# Altium project SOM Board with RK3399.PrjPcb (part 2 of 4)

## Sheet [8]-RK3399 SDRAM Page.SchDoc: RK3399 SOM Board Design V1.0
size A3; Author: ABC; Organization: Altium Limited; Address1: L3, 12a Rodborough Rd; Address2: Frenchs Forest; Address3: NSW; Address4: Australia 2086; DocumentNumber: 10; SheetNumber: 10; SheetTotal: 21; PROJECT CODE: A_V1.0
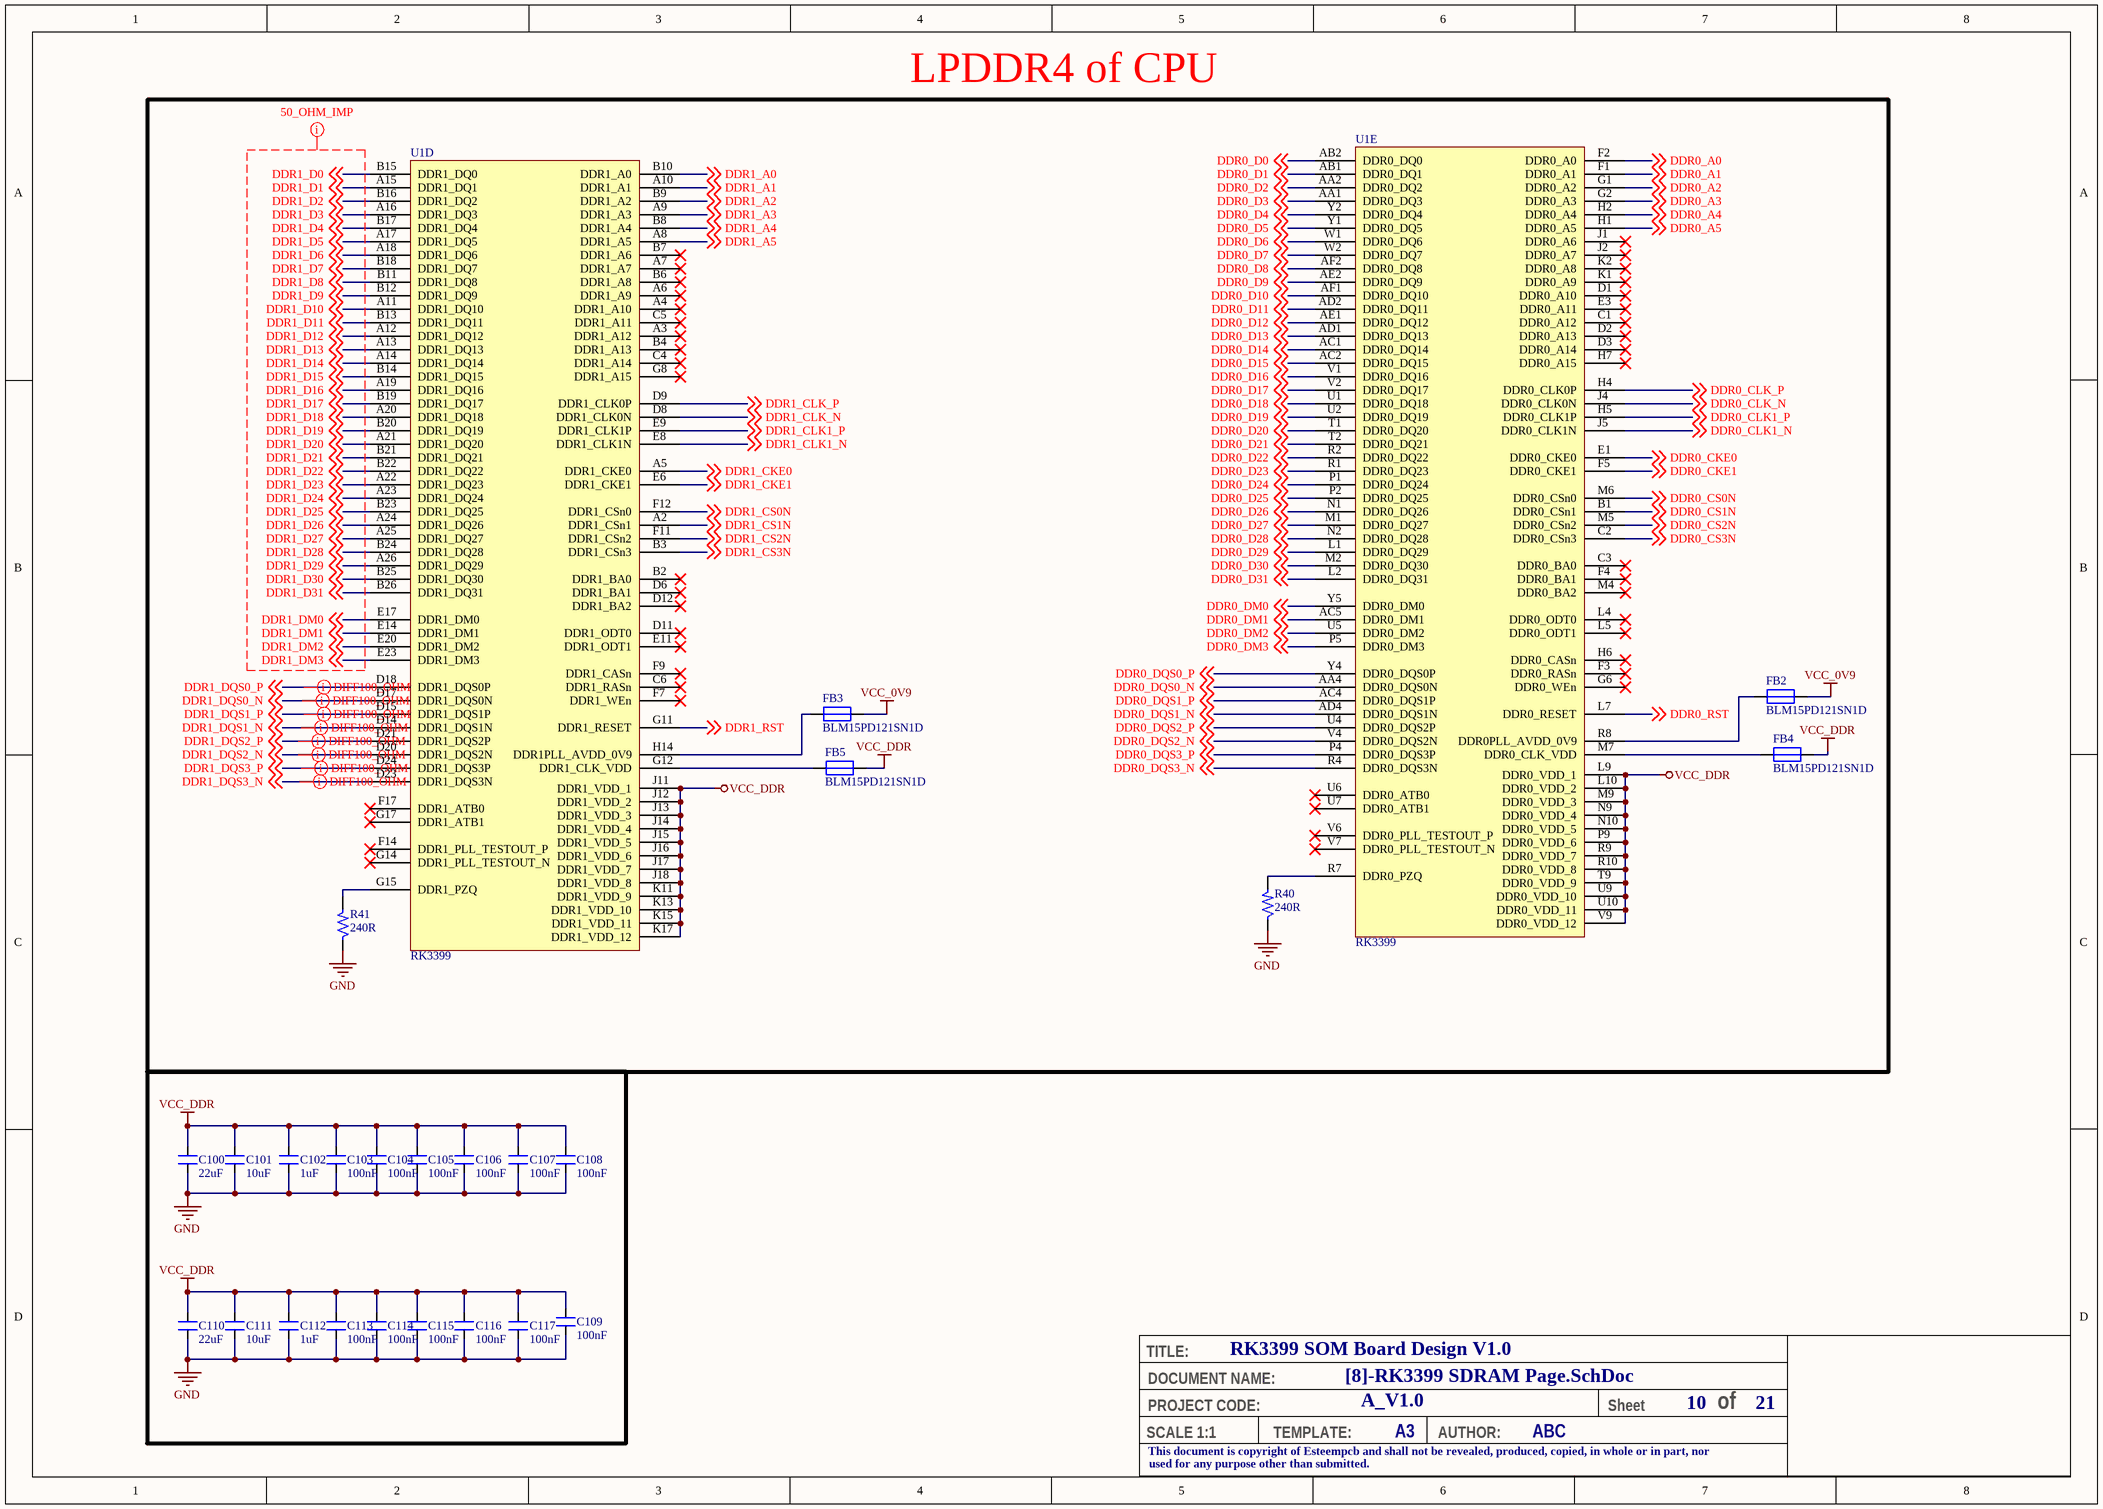
[diagram p9: [8]-RK3399 SDRAM Page.SchDoc]

### Parts
C100  22uF  [CAP_0402]
C101  10uF  [CAP_0402]
C102  1uF  [CAP_0201]
C103  100nF  [CAP_0201]
C104  100nF  [CAP_0201]
C105  100nF  [CAP_0201]
C106  100nF  [CAP_0201]
C107  100nF  [CAP_0201]
C108  100nF  [CAP_0201]
C109  100nF  [CAP_0201]
C110  22uF  [CAP_0402]
C111  10uF  [CAP_0402]
C112  1uF  [CAP_0201]
C113  100nF  [CAP_0201]
C114  100nF  [CAP_0201]
C115  100nF  [CAP_0201]
C116  100nF  [CAP_0201]
C117  100nF  [CAP_0201]
FB2  BLM15PD121SN1D  [RES_0402]
FB3  BLM15PD121SN1D  [RES_0402]
FB4  BLM15PD121SN1D  [RES_0402]
FB5  BLM15PD121SN1D  [RES_0402]
R40  240R  [RES_0201]
R41  240R  [RES_0201]
U1  RK3399  [FBGA828_23_826X826]  (parts D,E of 24)

### Blocks framed on the sheet
LPDDR4 of CPU: FB2-FB5 R40 R41 U1

### Nets
GND: C100.1 C101.1 C102.1 C103.1 C104.1 C105.1 C106.1 C107.1 C108.1 C109.1 C110.1 C111.1 C112.1 C113.1 C114.1 C115.1 C116.1 C117.1 R40.1 R41.1
VCC_0V9: FB2.2 FB3.2
VCC_DDR: C100.2 C101.2 C102.2 C103.2 C104.2 C105.2 C106.2 C107.2 C108.2 C109.2 C110.2 C111.2 C112.2 C113.2 C114.2 C115.2 C116.2 C117.2 FB4.2 FB5.2 U1.J11(DDR1_VDD_1) U1.J12(DDR1_VDD_2) U1.J13(DDR1_VDD_3) U1.J14(DDR1_VDD_4) U1.J15(DDR1_VDD_5) U1.J16(DDR1_VDD_6) U1.J17(DDR1_VDD_7) U1.J18(DDR1_VDD_8) U1.K11(DDR1_VDD_9) U1.K13(DDR1_VDD_10) U1.K15(DDR1_VDD_11) U1.K17(DDR1_VDD_12) U1.L9(DDR0_VDD_1) U1.L10(DDR0_VDD_2) U1.M9(DDR0_VDD_3) U1.N9(DDR0_VDD_4) U1.N10(DDR0_VDD_5) U1.P9(DDR0_VDD_6) U1.R9(DDR0_VDD_7) U1.R10(DDR0_VDD_8) U1.T9(DDR0_VDD_9) U1.U9(DDR0_VDD_10) U1.U10(DDR0_VDD_11) U1.V9(DDR0_VDD_12)
DDR0_A0: U1.F2(DDR0_A0) ; off-sheet DDR0_A0
DDR0_A1: U1.F1(DDR0_A1) ; off-sheet DDR0_A1
DDR0_A2: U1.G1(DDR0_A2) ; off-sheet DDR0_A2
DDR0_A3: U1.G2(DDR0_A3) ; off-sheet DDR0_A3
DDR0_A4: U1.H2(DDR0_A4) ; off-sheet DDR0_A4
DDR0_A5: U1.H1(DDR0_A5) ; off-sheet DDR0_A5
DDR0_CKE0: U1.E1(DDR0_CKE0) ; off-sheet DDR0_CKE0
DDR0_CKE1: U1.F5(DDR0_CKE1) ; off-sheet DDR0_CKE1
DDR0_CLK1_N: U1.J5(DDR0_CLK1N) ; off-sheet DDR0_CLK1_N
DDR0_CLK1_P: U1.H5(DDR0_CLK1P) ; off-sheet DDR0_CLK1_P
DDR0_CLK_N: U1.J4(DDR0_CLK0N) ; off-sheet DDR0_CLK_N
DDR0_CLK_P: U1.H4(DDR0_CLK0P) ; off-sheet DDR0_CLK_P
DDR0_CS0N: U1.M6(DDR0_CSn0) ; off-sheet DDR0_CS0N
DDR0_CS1N: U1.B1(DDR0_CSn1) ; off-sheet DDR0_CS1N
DDR0_CS2N: U1.M5(DDR0_CSn2) ; off-sheet DDR0_CS2N
DDR0_CS3N: U1.C2(DDR0_CSn3) ; off-sheet DDR0_CS3N
DDR0_D0: U1.AB2(DDR0_DQ0) ; off-sheet DDR0_D0
DDR0_D1: U1.AB1(DDR0_DQ1) ; off-sheet DDR0_D1
DDR0_D2: U1.AA2(DDR0_DQ2) ; off-sheet DDR0_D2
DDR0_D3: U1.AA1(DDR0_DQ3) ; off-sheet DDR0_D3
DDR0_D4: U1.Y2(DDR0_DQ4) ; off-sheet DDR0_D4
DDR0_D5: U1.Y1(DDR0_DQ5) ; off-sheet DDR0_D5
DDR0_D6: U1.W1(DDR0_DQ6) ; off-sheet DDR0_D6
DDR0_D7: U1.W2(DDR0_DQ7) ; off-sheet DDR0_D7
DDR0_D8: U1.AF2(DDR0_DQ8) ; off-sheet DDR0_D8
DDR0_D9: U1.AE2(DDR0_DQ9) ; off-sheet DDR0_D9
DDR0_D10: U1.AF1(DDR0_DQ10) ; off-sheet DDR0_D10
DDR0_D11: U1.AD2(DDR0_DQ11) ; off-sheet DDR0_D11
DDR0_D12: U1.AE1(DDR0_DQ12) ; off-sheet DDR0_D12
DDR0_D13: U1.AD1(DDR0_DQ13) ; off-sheet DDR0_D13
DDR0_D14: U1.AC1(DDR0_DQ14) ; off-sheet DDR0_D14
DDR0_D15: U1.AC2(DDR0_DQ15) ; off-sheet DDR0_D15
DDR0_D16: U1.V1(DDR0_DQ16) ; off-sheet DDR0_D16
DDR0_D17: U1.V2(DDR0_DQ17) ; off-sheet DDR0_D17
DDR0_D18: U1.U1(DDR0_DQ18) ; off-sheet DDR0_D18
DDR0_D19: U1.U2(DDR0_DQ19) ; off-sheet DDR0_D19
DDR0_D20: U1.T1(DDR0_DQ20) ; off-sheet DDR0_D20
DDR0_D21: U1.T2(DDR0_DQ21) ; off-sheet DDR0_D21
DDR0_D22: U1.R2(DDR0_DQ22) ; off-sheet DDR0_D22
DDR0_D23: U1.R1(DDR0_DQ23) ; off-sheet DDR0_D23
DDR0_D24: U1.P1(DDR0_DQ24) ; off-sheet DDR0_D24
DDR0_D25: U1.P2(DDR0_DQ25) ; off-sheet DDR0_D25
DDR0_D26: U1.N1(DDR0_DQ26) ; off-sheet DDR0_D26
DDR0_D27: U1.M1(DDR0_DQ27) ; off-sheet DDR0_D27
DDR0_D28: U1.N2(DDR0_DQ28) ; off-sheet DDR0_D28
DDR0_D29: U1.L1(DDR0_DQ29) ; off-sheet DDR0_D29
DDR0_D30: U1.M2(DDR0_DQ30) ; off-sheet DDR0_D30
DDR0_D31: U1.L2(DDR0_DQ31) ; off-sheet DDR0_D31
DDR0_DM0: U1.Y5(DDR0_DM0) ; off-sheet DDR0_DM0
DDR0_DM1: U1.AC5(DDR0_DM1) ; off-sheet DDR0_DM1
DDR0_DM2: U1.U5(DDR0_DM2) ; off-sheet DDR0_DM2
DDR0_DM3: U1.P5(DDR0_DM3) ; off-sheet DDR0_DM3
DDR0_DQS0_N: U1.AA4(DDR0_DQS0N) ; off-sheet DDR0_DQS0_N
DDR0_DQS0_P: U1.Y4(DDR0_DQS0P) ; off-sheet DDR0_DQS0_P
DDR0_DQS1_N: U1.AD4(DDR0_DQS1N) ; off-sheet DDR0_DQS1_N
DDR0_DQS1_P: U1.AC4(DDR0_DQS1P) ; off-sheet DDR0_DQS1_P
DDR0_DQS2_N: U1.V4(DDR0_DQS2N) ; off-sheet DDR0_DQS2_N
DDR0_DQS2_P: U1.U4(DDR0_DQS2P) ; off-sheet DDR0_DQS2_P
DDR0_DQS3_N: U1.R4(DDR0_DQS3N) ; off-sheet DDR0_DQS3_N
DDR0_DQS3_P: U1.P4(DDR0_DQS3P) ; off-sheet DDR0_DQS3_P
DDR0_RST: U1.L7(DDR0_RESET) ; off-sheet DDR0_RST
DDR1_A0: U1.B10(DDR1_A0) ; off-sheet DDR1_A0
DDR1_A1: U1.A10(DDR1_A1) ; off-sheet DDR1_A1
DDR1_A2: U1.B9(DDR1_A2) ; off-sheet DDR1_A2
DDR1_A3: U1.A9(DDR1_A3) ; off-sheet DDR1_A3
DDR1_A4: U1.B8(DDR1_A4) ; off-sheet DDR1_A4
DDR1_A5: U1.A8(DDR1_A5) ; off-sheet DDR1_A5
DDR1_CKE0: U1.A5(DDR1_CKE0) ; off-sheet DDR1_CKE0
DDR1_CKE1: U1.E6(DDR1_CKE1) ; off-sheet DDR1_CKE1
DDR1_CLK1_N: U1.E8(DDR1_CLK1N) ; off-sheet DDR1_CLK1_N
DDR1_CLK1_P: U1.E9(DDR1_CLK1P) ; off-sheet DDR1_CLK1_P
DDR1_CLK_N: U1.D8(DDR1_CLK0N) ; off-sheet DDR1_CLK_N
DDR1_CLK_P: U1.D9(DDR1_CLK0P) ; off-sheet DDR1_CLK_P
DDR1_CS0N: U1.F12(DDR1_CSn0) ; off-sheet DDR1_CS0N
DDR1_CS1N: U1.A2(DDR1_CSn1) ; off-sheet DDR1_CS1N
DDR1_CS2N: U1.F11(DDR1_CSn2) ; off-sheet DDR1_CS2N
DDR1_CS3N: U1.B3(DDR1_CSn3) ; off-sheet DDR1_CS3N
DDR1_D0: U1.B15(DDR1_DQ0) ; off-sheet DDR1_D0
DDR1_D1: U1.A15(DDR1_DQ1) ; off-sheet DDR1_D1
DDR1_D2: U1.B16(DDR1_DQ2) ; off-sheet DDR1_D2
DDR1_D3: U1.A16(DDR1_DQ3) ; off-sheet DDR1_D3
DDR1_D4: U1.B17(DDR1_DQ4) ; off-sheet DDR1_D4
DDR1_D5: U1.A17(DDR1_DQ5) ; off-sheet DDR1_D5
DDR1_D6: U1.A18(DDR1_DQ6) ; off-sheet DDR1_D6
DDR1_D7: U1.B18(DDR1_DQ7) ; off-sheet DDR1_D7
DDR1_D8: U1.B11(DDR1_DQ8) ; off-sheet DDR1_D8
DDR1_D9: U1.B12(DDR1_DQ9) ; off-sheet DDR1_D9
DDR1_D10: U1.A11(DDR1_DQ10) ; off-sheet DDR1_D10
DDR1_D11: U1.B13(DDR1_DQ11) ; off-sheet DDR1_D11
DDR1_D12: U1.A12(DDR1_DQ12) ; off-sheet DDR1_D12
DDR1_D13: U1.A13(DDR1_DQ13) ; off-sheet DDR1_D13
DDR1_D14: U1.A14(DDR1_DQ14) ; off-sheet DDR1_D14
DDR1_D15: U1.B14(DDR1_DQ15) ; off-sheet DDR1_D15
DDR1_D16: U1.A19(DDR1_DQ16) ; off-sheet DDR1_D16
DDR1_D17: U1.B19(DDR1_DQ17) ; off-sheet DDR1_D17
DDR1_D18: U1.A20(DDR1_DQ18) ; off-sheet DDR1_D18
DDR1_D19: U1.B20(DDR1_DQ19) ; off-sheet DDR1_D19
DDR1_D20: U1.A21(DDR1_DQ20) ; off-sheet DDR1_D20
DDR1_D21: U1.B21(DDR1_DQ21) ; off-sheet DDR1_D21
DDR1_D22: U1.B22(DDR1_DQ22) ; off-sheet DDR1_D22
DDR1_D23: U1.A22(DDR1_DQ23) ; off-sheet DDR1_D23
DDR1_D24: U1.A23(DDR1_DQ24) ; off-sheet DDR1_D24
DDR1_D25: U1.B23(DDR1_DQ25) ; off-sheet DDR1_D25
DDR1_D26: U1.A24(DDR1_DQ26) ; off-sheet DDR1_D26
DDR1_D27: U1.A25(DDR1_DQ27) ; off-sheet DDR1_D27
DDR1_D28: U1.B24(DDR1_DQ28) ; off-sheet DDR1_D28
DDR1_D29: U1.A26(DDR1_DQ29) ; off-sheet DDR1_D29
DDR1_D30: U1.B25(DDR1_DQ30) ; off-sheet DDR1_D30
DDR1_D31: U1.B26(DDR1_DQ31) ; off-sheet DDR1_D31
DDR1_DM0: U1.E17(DDR1_DM0) ; off-sheet DDR1_DM0
DDR1_DM1: U1.E14(DDR1_DM1) ; off-sheet DDR1_DM1
DDR1_DM2: U1.E20(DDR1_DM2) ; off-sheet DDR1_DM2
DDR1_DM3: U1.E23(DDR1_DM3) ; off-sheet DDR1_DM3
DDR1_DQS0_N: U1.D17(DDR1_DQS0N) ; off-sheet DDR1_DQS0_N
DDR1_DQS0_P: U1.D18(DDR1_DQS0P) ; off-sheet DDR1_DQS0_P
DDR1_DQS1_N: U1.D14(DDR1_DQS1N) ; off-sheet DDR1_DQS1_N
DDR1_DQS1_P: U1.D15(DDR1_DQS1P) ; off-sheet DDR1_DQS1_P
DDR1_DQS2_N: U1.D20(DDR1_DQS2N) ; off-sheet DDR1_DQS2_N
DDR1_DQS2_P: U1.D21(DDR1_DQS2P) ; off-sheet DDR1_DQS2_P
DDR1_DQS3_N: U1.D23(DDR1_DQS3N) ; off-sheet DDR1_DQS3_N
DDR1_DQS3_P: U1.D24(DDR1_DQS3P) ; off-sheet DDR1_DQS3_P
DDR1_RST: U1.G11(DDR1_RESET) ; off-sheet DDR1_RST
NetFB2_1: FB2.1 U1.R8(DDR0PLL_AVDD_0V9)
NetFB3_1: FB3.1 U1.H14(DDR1PLL_AVDD_0V9)
NetFB4_1: FB4.1 U1.M7(DDR0_CLK_VDD)
NetFB5_1: FB5.1 U1.G12(DDR1_CLK_VDD)
NetR40_2: R40.2 U1.R7(DDR0_PZQ)
NetR41_2: R41.2 U1.G15(DDR1_PZQ)

Not connected (* = marked no-connect by the designer): U1 A3(DDR1_A12)* A4(DDR1_A10)* A6(DDR1_A9)* A7(DDR1_A7)* B2(DDR1_BA0)* B4(DDR1_A13)* B6(DDR1_A8)* B7(DDR1_A6)* C1(DDR0_A12)* C3(DDR0_BA0)* C4(DDR1_A14)* C5(DDR1_A11)* C6(DDR1_RASn)* D1(DDR0_A10)* D2(DDR0_A13)* D3(DDR0_A14)* D6(DDR1_BA1)* D11(DDR1_ODT0)* D12(DDR1_BA2)* E3(DDR0_A11)* E11(DDR1_ODT1)* F3(DDR0_RASn)* F4(DDR0_BA1)* F7(DDR1_WEn)* F9(DDR1_CASn)* F14(DDR1_PLL_TESTOUT_P)* F17(DDR1_ATB0)* G6(DDR0_WEn)* G8(DDR1_A15)* G14(DDR1_PLL_TESTOUT_N)* G17(DDR1_ATB1)* H6(DDR0_CASn)* H7(DDR0_A15)* J1(DDR0_A6)* J2(DDR0_A7)* K1(DDR0_A9)* K2(DDR0_A8)* L4(DDR0_ODT0)* L5(DDR0_ODT1)* M4(DDR0_BA2)* U6(DDR0_ATB0)* U7(DDR0_ATB1)* V6(DDR0_PLL_TESTOUT_P)* V7(DDR0_PLL_TESTOUT_N)*

### Layout directives
net class 50_OHM_IMP: DDR1_D0, DDR1_D1, DDR1_D2, DDR1_D3, DDR1_D4, DDR1_D5, DDR1_D6, DDR1_D7, DDR1_D8, DDR1_D9, DDR1_D10, DDR1_D11, DDR1_D12, DDR1_D13, DDR1_D14, DDR1_D15, DDR1_D16, DDR1_D17, DDR1_D18, DDR1_D19, DDR1_D20, DDR1_D21, DDR1_D22, DDR1_D23, DDR1_D24, DDR1_D25, DDR1_D26, DDR1_D27, DDR1_D28, DDR1_D29, DDR1_D30, DDR1_D31, DDR1_DM0, DDR1_DM1, DDR1_DM2, DDR1_DM3
differential pair; differential pair class DIIF_100_OHM: DDR1_DQS0_N, DDR1_DQS0_P, DDR1_DQS1_N, DDR1_DQS1_P, DDR1_DQS2_N, DDR1_DQS2_P, DDR1_DQS3_N, DDR1_DQS3_P

### Notes on the sheet
- TITLE:
- DOCUMENT NAME:
- SCALE 1:1
- This document is copyright of Esteempcb and shall not be revealed, produced, copied, in whole or in part, nor
- PROJECT CODE:
- TEMPLATE:
- A3
- AUTHOR:
- Sheet
- of
- used for any purpose other than submitted.

### Library data of the parts
C100 C110 = CAP_22uF-6.3V-20%-0402: 22µF ±20% 6.3V Ceramic Capacitor X5R 0402 (1005 Metric) /; Manufacturer: Murata Electronics; Manufacturer Part Number: CL05A226MQ5N6J8; Case/Package: 0402; Supplier-1: Digikey
C101 C111 = CAP_10uF-10V-20%-0402: 10µF ±20% 10V Ceramic Capacitor X5R 0402 (1005 Metric) /; Manufacturer Part Number: CL05A106MP5NUNC; Manufacturer: Samsung Electro-Mechanics; Case/Package: 0402; Supplier-1: Digikey
C102 C112 = CAP_1uF-16V-10%-0201: 1µF ±20% 16V Ceramic Capacitor X5R 0201 (0603 Metric) /; Manufacturer: Samsung Electro-Mechanics; Manufacturer Part Number: CL03A105MO3NRNH; Case/Package: 0201; Supplier-1: Digikey
C103-C109 C113-C117 = CAP_100nF-25V-10%-0201: 0.1µF ±10% 25V Ceramic Capacitor X5R 0201 (0603 Metric) /; Manufacturer: TDK Corporation; Manufacturer Part Number: C0603X5R1E104K030BB; Case/Package: 0201; Supplier-1: Digikey
FB2-FB5 = FB_120R-1.3A-100Mhz-0402: 120 Ohms @ 100MHz 1 Power Line Ferrite Bead 0402 (1005 Metric) 1.3A 90mOhm; Manufacturer: Murata Electronics; Mnaufacturer Part Number: BLM15PD121SN1D; Case/Package: 0402; Supplier-1: Digikey
R40 R41 = RES_240R-0.05W-1%-0201: 240 Ohms ±1% 0.05W, 1/20W Chip Resistor 0201 (0603 Metric) Thick Film /; Manufacturer: Yageo; Manufacturer Part Number: RC0201FR-07240RL; Case/Package: 0201; Supplier-1: Digikey
U1 = IC_RK3399-FCBGA828: RK3399 is a low power, high performance processor for computing, personal mobile.; Manufacturer: Rockchip; Manufacturer Part Number: RK3399; Case/Package: FCBGA828; Supplier-1: Rockchip

## Sheet [9]-LPDDR4 SDRAM-1.SchDoc: RK3399 SOM Board Design V1.0
size A3; Author: ABC; Organization: Altium Limited; Address1: L3, 12a Rodborough Rd; Address2: Frenchs Forest; Address3: NSW; Address4: Australia 2086; DocumentNumber: 11; SheetNumber: 11; SheetTotal: 21; PROJECT CODE: A_V1.0
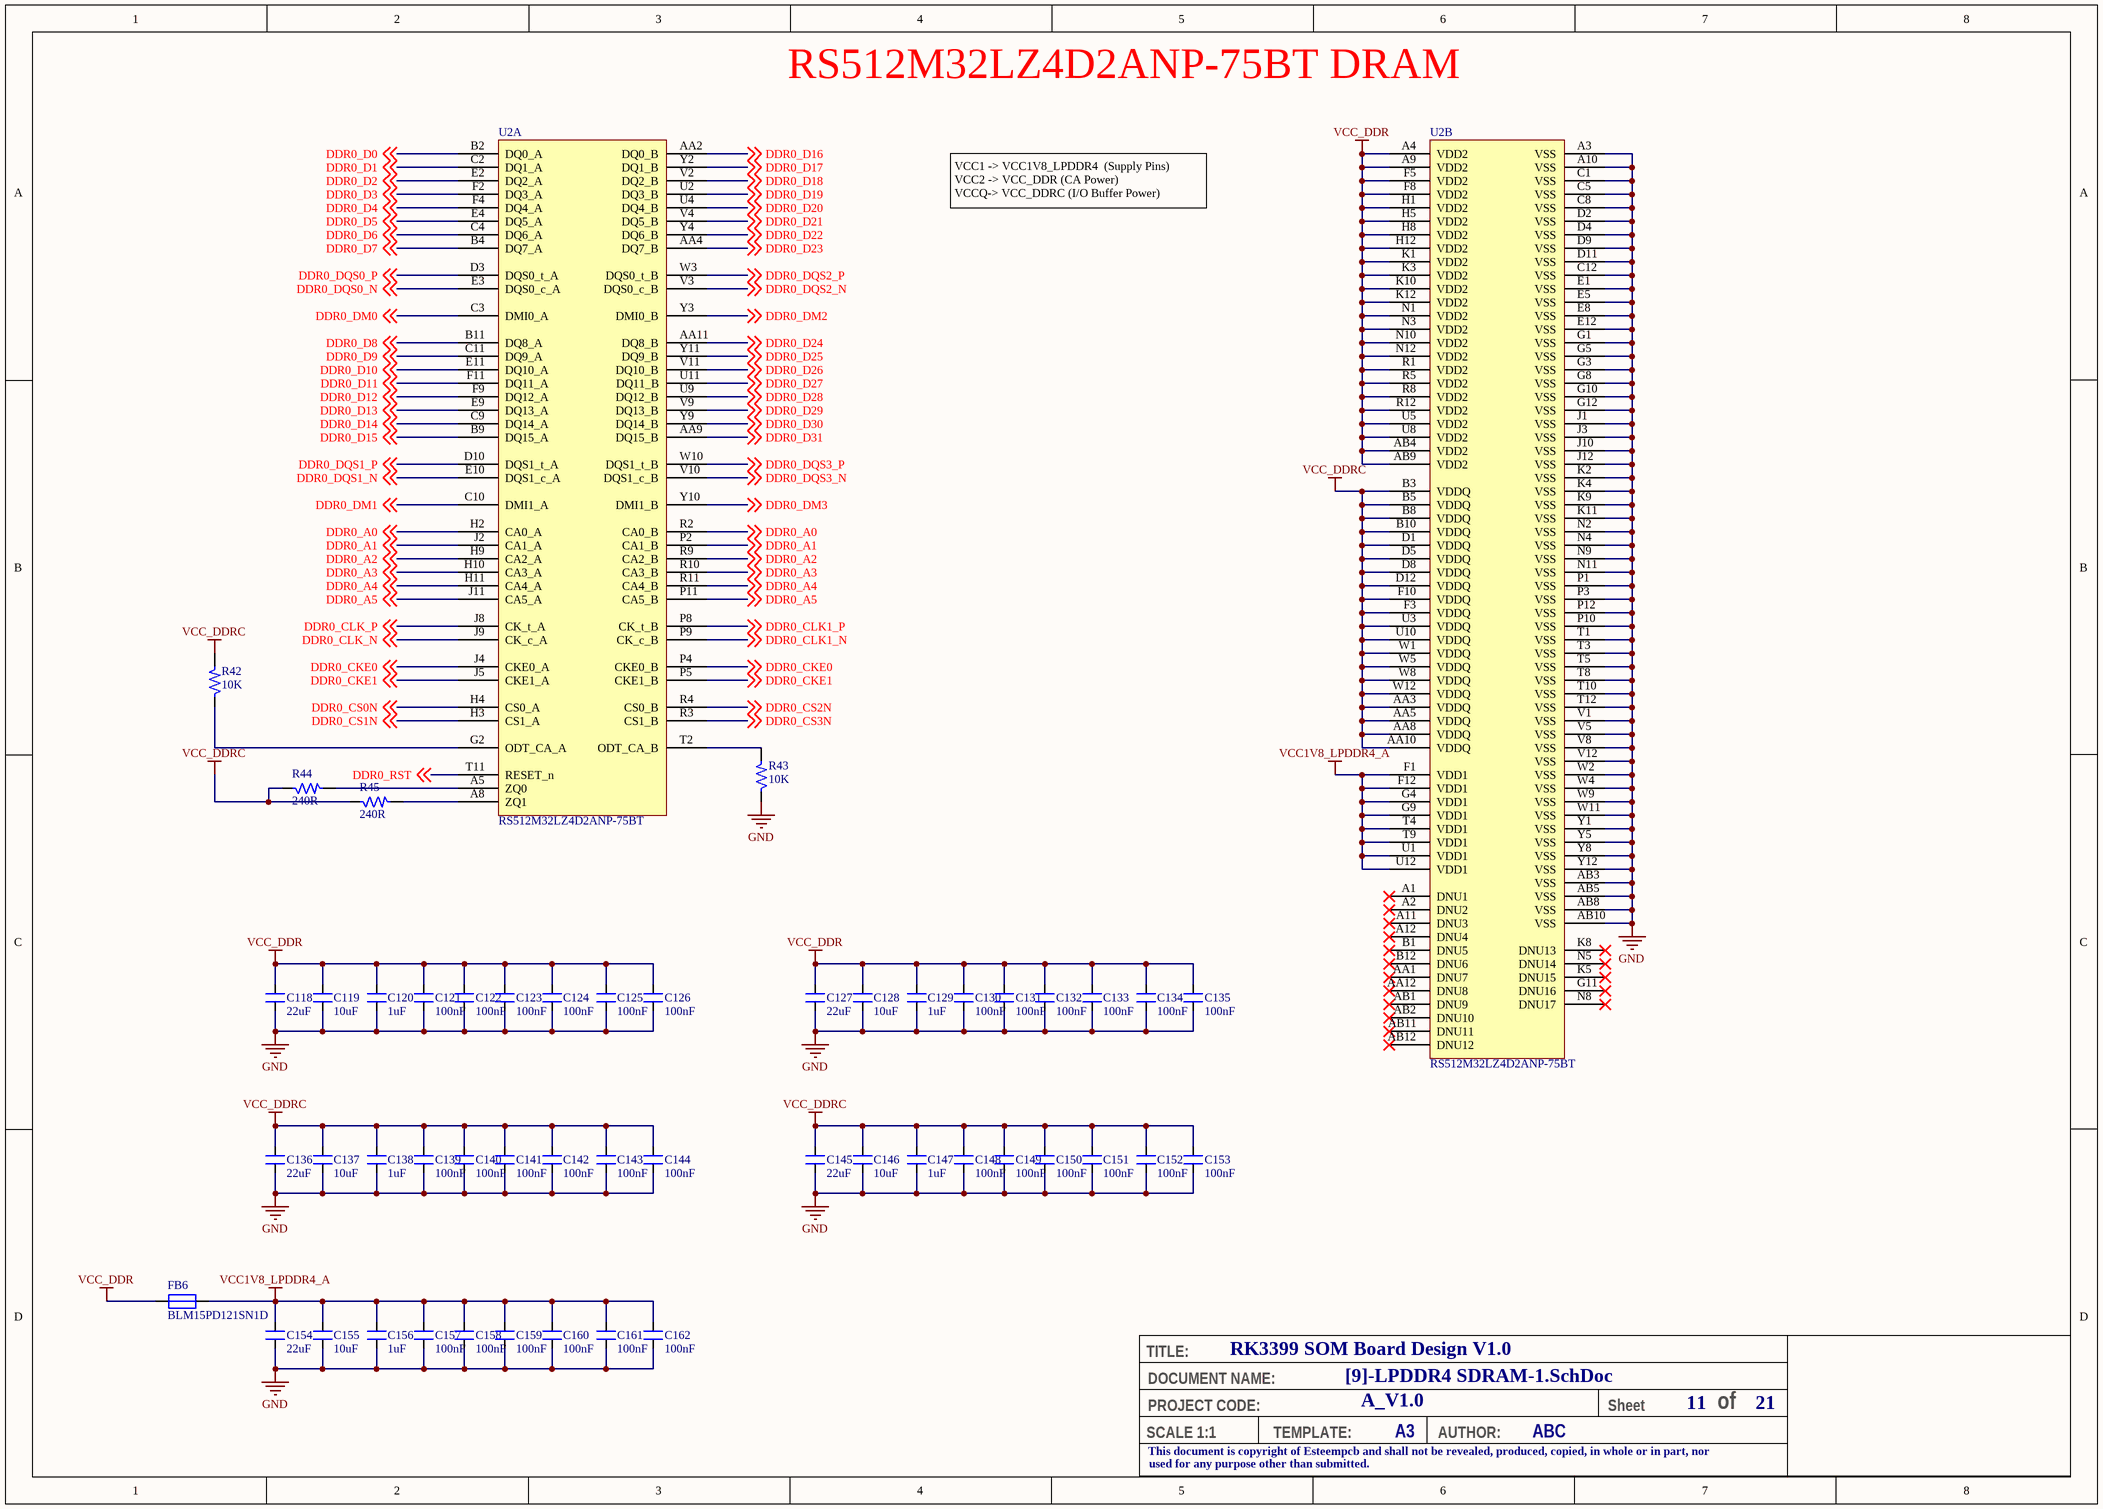
[diagram p10: [9]-LPDDR4 SDRAM-1.SchDoc]

### Parts
C118  22uF  [CAP_0402]
C119  10uF  [CAP_0402]
C120  1uF  [CAP_0201]
C121  100nF  [CAP_0201]
C122  100nF  [CAP_0201]
C123  100nF  [CAP_0201]
C124  100nF  [CAP_0201]
C125  100nF  [CAP_0201]
C126  100nF  [CAP_0201]
C127  22uF  [CAP_0402]
C128  10uF  [CAP_0402]
C129  1uF  [CAP_0201]
C130  100nF  [CAP_0201]
C131  100nF  [CAP_0201]
C132  100nF  [CAP_0201]
C133  100nF  [CAP_0201]
C134  100nF  [CAP_0201]
C135  100nF  [CAP_0201]
C136  22uF  [CAP_0402]
C137  10uF  [CAP_0402]
C138  1uF  [CAP_0201]
C139  100nF  [CAP_0201]
C140  100nF  [CAP_0201]
C141  100nF  [CAP_0201]
C142  100nF  [CAP_0201]
C143  100nF  [CAP_0201]
C144  100nF  [CAP_0201]
C145  22uF  [CAP_0402]
C146  10uF  [CAP_0402]
C147  1uF  [CAP_0201]
C148  100nF  [CAP_0201]
C149  100nF  [CAP_0201]
C150  100nF  [CAP_0201]
C151  100nF  [CAP_0201]
C152  100nF  [CAP_0201]
C153  100nF  [CAP_0201]
C154  22uF  [CAP_0402]
C155  10uF  [CAP_0402]
C156  1uF  [CAP_0201]
C157  100nF  [CAP_0201]
C158  100nF  [CAP_0201]
C159  100nF  [CAP_0201]
C160  100nF  [CAP_0201]
C161  100nF  [CAP_0201]
C162  100nF  [CAP_0201]
FB6  BLM15PD121SN1D  [RES_0402]
R42  10K  [RES_0201]
R43  10K  [RES_0201]
R44  240R  [RES_0201]
R45  240R  [RES_0201]
U2  RS512M32LZ4D2ANP-75BT  [FBGA200_SMD]  (parts A,B of 2)

### Nets
GND: C118.1 C119.1 C120.1 C121.1 C122.1 C123.1 C124.1 C125.1 C126.1 C127.1 C128.1 C129.1 C130.1 C131.1 C132.1 C133.1 C134.1 C135.1 C136.1 C137.1 C138.1 C139.1 C140.1 C141.1 C142.1 C143.1 C144.1 C145.1 C146.1 C147.1 C148.1 C149.1 C150.1 C151.1 C152.1 C153.1 C154.1 C155.1 C156.1 C157.1 C158.1 C159.1 C160.1 C161.1 C162.1 R43.1 U2.A3(VSS) U2.A10(VSS) U2.AB3(VSS) U2.AB5(VSS) U2.AB8(VSS) U2.AB10(VSS) U2.C1(VSS) U2.C5(VSS) U2.C8(VSS) U2.C12(VSS) U2.D2(VSS) U2.D4(VSS) U2.D9(VSS) U2.D11(VSS) U2.E1(VSS) U2.E5(VSS) U2.E8(VSS) U2.E12(VSS) U2.G1(VSS) U2.G3(VSS) U2.G5(VSS) U2.G8(VSS) U2.G10(VSS) U2.G12(VSS) U2.J1(VSS) U2.J3(VSS) U2.J10(VSS) U2.J12(VSS) U2.K2(VSS) U2.K4(VSS) U2.K9(VSS) U2.K11(VSS) U2.N2(VSS) U2.N4(VSS) U2.N9(VSS) U2.N11(VSS) U2.P1(VSS) U2.P3(VSS) U2.P10(VSS) U2.P12(VSS) U2.T1(VSS) U2.T3(VSS) U2.T5(VSS) U2.T8(VSS) U2.T10(VSS) U2.T12(VSS) U2.V1(VSS) U2.V5(VSS) U2.V8(VSS) U2.V12(VSS) U2.W2(VSS) U2.W4(VSS) U2.W9(VSS) U2.W11(VSS) U2.Y1(VSS) U2.Y5(VSS) U2.Y8(VSS) U2.Y12(VSS)
VCC1V8_LPDDR4_A: C154.2 C155.2 C156.2 C157.2 C158.2 C159.2 C160.2 C161.2 C162.2 FB6.2 U2.F1(VDD1) U2.F12(VDD1) U2.G4(VDD1) U2.G9(VDD1) U2.T4(VDD1) U2.T9(VDD1) U2.U1(VDD1) U2.U12(VDD1)
VCC_DDR: C118.2 C119.2 C120.2 C121.2 C122.2 C123.2 C124.2 C125.2 C126.2 C127.2 C128.2 C129.2 C130.2 C131.2 C132.2 C133.2 C134.2 C135.2 FB6.1 U2.A4(VDD2) U2.A9(VDD2) U2.AB4(VDD2) U2.AB9(VDD2) U2.F5(VDD2) U2.F8(VDD2) U2.H1(VDD2) U2.H5(VDD2) U2.H8(VDD2) U2.H12(VDD2) U2.K1(VDD2) U2.K3(VDD2) U2.K10(VDD2) U2.K12(VDD2) U2.N1(VDD2) U2.N3(VDD2) U2.N10(VDD2) U2.N12(VDD2) U2.R1(VDD2) U2.R5(VDD2) U2.R8(VDD2) U2.R12(VDD2) U2.U5(VDD2) U2.U8(VDD2)
VCC_DDRC: C136.2 C137.2 C138.2 C139.2 C140.2 C141.2 C142.2 C143.2 C144.2 C145.2 C146.2 C147.2 C148.2 C149.2 C150.2 C151.2 C152.2 C153.2 R42.2 R44.1 R45.1 U2.AA3(VDDQ) U2.AA5(VDDQ) U2.AA8(VDDQ) U2.AA10(VDDQ) U2.B3(VDDQ) U2.B5(VDDQ) U2.B8(VDDQ) U2.B10(VDDQ) U2.D1(VDDQ) U2.D5(VDDQ) U2.D8(VDDQ) U2.D12(VDDQ) U2.F3(VDDQ) U2.F10(VDDQ) U2.U3(VDDQ) U2.U10(VDDQ) U2.W1(VDDQ) U2.W5(VDDQ) U2.W8(VDDQ) U2.W12(VDDQ)
DDR0_A0: U2.H2(CA0_A) U2.R2(CA0_B) ; off-sheet DDR0_A0
DDR0_A1: U2.J2(CA1_A) U2.P2(CA1_B) ; off-sheet DDR0_A1
DDR0_A2: U2.H9(CA2_A) U2.R9(CA2_B) ; off-sheet DDR0_A2
DDR0_A3: U2.H10(CA3_A) U2.R10(CA3_B) ; off-sheet DDR0_A3
DDR0_A4: U2.H11(CA4_A) U2.R11(CA4_B) ; off-sheet DDR0_A4
DDR0_A5: U2.J11(CA5_A) U2.P11(CA5_B) ; off-sheet DDR0_A5
DDR0_CKE0: U2.J4(CKE0_A) U2.P4(CKE0_B) ; off-sheet DDR0_CKE0
DDR0_CKE1: U2.J5(CKE1_A) U2.P5(CKE1_B) ; off-sheet DDR0_CKE1
DDR0_CLK1_N: U2.P9(CK_c_B) ; off-sheet DDR0_CLK1_N
DDR0_CLK1_P: U2.P8(CK_t_B) ; off-sheet DDR0_CLK1_P
DDR0_CLK_N: U2.J9(CK_c_A) ; off-sheet DDR0_CLK_N
DDR0_CLK_P: U2.J8(CK_t_A) ; off-sheet DDR0_CLK_P
DDR0_CS0N: U2.H4(CS0_A) ; off-sheet DDR0_CS0N
DDR0_CS1N: U2.H3(CS1_A) ; off-sheet DDR0_CS1N
DDR0_CS2N: U2.R4(CS0_B) ; off-sheet DDR0_CS2N
DDR0_CS3N: U2.R3(CS1_B) ; off-sheet DDR0_CS3N
DDR0_D0: U2.B2(DQ0_A) ; off-sheet DDR0_D0
DDR0_D1: U2.C2(DQ1_A) ; off-sheet DDR0_D1
DDR0_D2: U2.E2(DQ2_A) ; off-sheet DDR0_D2
DDR0_D3: U2.F2(DQ3_A) ; off-sheet DDR0_D3
DDR0_D4: U2.F4(DQ4_A) ; off-sheet DDR0_D4
DDR0_D5: U2.E4(DQ5_A) ; off-sheet DDR0_D5
DDR0_D6: U2.C4(DQ6_A) ; off-sheet DDR0_D6
DDR0_D7: U2.B4(DQ7_A) ; off-sheet DDR0_D7
DDR0_D8: U2.B11(DQ8_A) ; off-sheet DDR0_D8
DDR0_D9: U2.C11(DQ9_A) ; off-sheet DDR0_D9
DDR0_D10: U2.E11(DQ10_A) ; off-sheet DDR0_D10
DDR0_D11: U2.F11(DQ11_A) ; off-sheet DDR0_D11
DDR0_D12: U2.F9(DQ12_A) ; off-sheet DDR0_D12
DDR0_D13: U2.E9(DQ13_A) ; off-sheet DDR0_D13
DDR0_D14: U2.C9(DQ14_A) ; off-sheet DDR0_D14
DDR0_D15: U2.B9(DQ15_A) ; off-sheet DDR0_D15
DDR0_D16: U2.AA2(DQ0_B) ; off-sheet DDR0_D16
DDR0_D17: U2.Y2(DQ1_B) ; off-sheet DDR0_D17
DDR0_D18: U2.V2(DQ2_B) ; off-sheet DDR0_D18
DDR0_D19: U2.U2(DQ3_B) ; off-sheet DDR0_D19
DDR0_D20: U2.U4(DQ4_B) ; off-sheet DDR0_D20
DDR0_D21: U2.V4(DQ5_B) ; off-sheet DDR0_D21
DDR0_D22: U2.Y4(DQ6_B) ; off-sheet DDR0_D22
DDR0_D23: U2.AA4(DQ7_B) ; off-sheet DDR0_D23
DDR0_D24: U2.AA11(DQ8_B) ; off-sheet DDR0_D24
DDR0_D25: U2.Y11(DQ9_B) ; off-sheet DDR0_D25
DDR0_D26: U2.V11(DQ10_B) ; off-sheet DDR0_D26
DDR0_D27: U2.U11(DQ11_B) ; off-sheet DDR0_D27
DDR0_D28: U2.U9(DQ12_B) ; off-sheet DDR0_D28
DDR0_D29: U2.V9(DQ13_B) ; off-sheet DDR0_D29
DDR0_D30: U2.Y9(DQ14_B) ; off-sheet DDR0_D30
DDR0_D31: U2.AA9(DQ15_B) ; off-sheet DDR0_D31
DDR0_DM0: U2.C3(DMI0_A) ; off-sheet DDR0_DM0
DDR0_DM1: U2.C10(DMI1_A) ; off-sheet DDR0_DM1
DDR0_DM2: U2.Y3(DMI0_B) ; off-sheet DDR0_DM2
DDR0_DM3: U2.Y10(DMI1_B) ; off-sheet DDR0_DM3
DDR0_DQS0_N: U2.E3(DQS0_c_A) ; off-sheet DDR0_DQS0_N
DDR0_DQS0_P: U2.D3(DQS0_t_A) ; off-sheet DDR0_DQS0_P
DDR0_DQS1_N: U2.E10(DQS1_c_A) ; off-sheet DDR0_DQS1_N
DDR0_DQS1_P: U2.D10(DQS1_t_A) ; off-sheet DDR0_DQS1_P
DDR0_DQS2_N: U2.V3(DQS0_c_B) ; off-sheet DDR0_DQS2_N
DDR0_DQS2_P: U2.W3(DQS0_t_B) ; off-sheet DDR0_DQS2_P
DDR0_DQS3_N: U2.V10(DQS1_c_B) ; off-sheet DDR0_DQS3_N
DDR0_DQS3_P: U2.W10(DQS1_t_B) ; off-sheet DDR0_DQS3_P
DDR0_RST: U2.T11(RESET_n) ; off-sheet DDR0_RST
NetR42_1: R42.1 U2.G2(ODT_CA_A)
NetR43_2: R43.2 U2.T2(ODT_CA_B)
NetR44_2: R44.2 U2.A5(ZQ0)
NetR45_2: R45.2 U2.A8(ZQ1)

Not connected (* = marked no-connect by the designer): U2 A1(DNU1)* A2(DNU2)* A11(DNU3)* A12(DNU4)* AA1(DNU7)* AA12(DNU8)* AB1(DNU9)* AB2(DNU10)* AB11(DNU11)* AB12(DNU12)* B1(DNU5)* B12(DNU6)* G11(DNU16)* K5(DNU15)* K8(DNU13)* N5(DNU14)* N8(DNU17)*

### Notes on the sheet
- RS512M32LZ4D2ANP-75BT DRAM
- VCC1 -> VCC1V8_LPDDR4  (Supply Pins)
  VCC2 -> VCC_DDR (CA Power)
  VCCQ-> VCC_DDRC (I/O Buffer Power)
- TITLE:
- DOCUMENT NAME:
- SCALE 1:1
- This document is copyright of Esteempcb and shall not be revealed, produced, copied, in whole or in part, nor
- PROJECT CODE:
- TEMPLATE:
- A3
- AUTHOR:
- Sheet
- of
- used for any purpose other than submitted.

### Library data of the parts
C118 C127 C136 C145 C154 = CAP_22uF-6.3V-20%-0402: as C100 on sheet [8]-RK3399 SDRAM Page; Case/Package: 0402; Supplier-1: Digikey
C119 C128 C137 C146 C155 = CAP_10uF-10V-20%-0402: as C101 on sheet [8]-RK3399 SDRAM Page; Case/Package: 0402; Supplier-1: Digikey
C120 C129 C138 C147 C156 = CAP_1uF-16V-10%-0201: as C102 on sheet [8]-RK3399 SDRAM Page; Case/Package: 0201; Supplier-1: Digikey
C121-C126 C130-C135 C139-C144 C148-C153 C157-C162 = CAP_100nF-25V-10%-0201: as C103-C109 on sheet [8]-RK3399 SDRAM Page; Case/Package: 0201; Supplier-1: Digikey
FB6 = FB_120R-1.3A-100Mhz-0402: as FB2-FB5 on sheet [8]-RK3399 SDRAM Page; Mnaufacturer Part Number: BLM15PD121SN1D; Case/Package: 0402; Supplier-1: Digikey
R42 R43 = RES_10K-0.05W-1%-0201: 10 kOhms ±1% 0.05W, 1/20W Chip Resistor 0201 (0603 Metric) Thick Film /; Manufacturer: Stackpole Electronics Inc; Manufacturer Part Number: RMCF0201FT10K0; Case/Package: 0201; Supplier-1: Digikey
R44 R45 = RES_240R-0.05W-1%-0201: as R40 on sheet [8]-RK3399 SDRAM Page; Case/Package: 0201; Supplier-1: Digikey
U2 = IC_RS512M32LZ4D2ANP-75BT: LPDDR4/4X Package FBGA 200b Density 4Gbit~64Gbit Operating Temperature Range：-25~85℃ Speed：2667Mbps/3200Mbps/3733Mbps Voltage：VDD1/VDD2/VDDQ= 1.8 / 1.1 / 1.1 V（LPDDR4）VDD1/VDD2/VDDQ = 1.8 / 1.1 / 0.6 V（LPDDR4X）Approved Verification Platform：MTK、Spreadtrum; Manufacturer: RAYSON; Manufacturer Part Number: RS512M32LZ4D2ANP-75BT; Case/Package: FBGA 200b; Supplier-1: RAYSON

## Sheet [10]-LPDDR4 SDRAM-2.SchDoc: RK3399 SOM Board Design V1.0
size A3; Author: ABC; Organization: Altium Limited; Address1: L3, 12a Rodborough Rd; Address2: Frenchs Forest; Address3: NSW; Address4: Australia 2086; DocumentNumber: 12; SheetNumber: 12; SheetTotal: 21; PROJECT CODE: A_V1.0
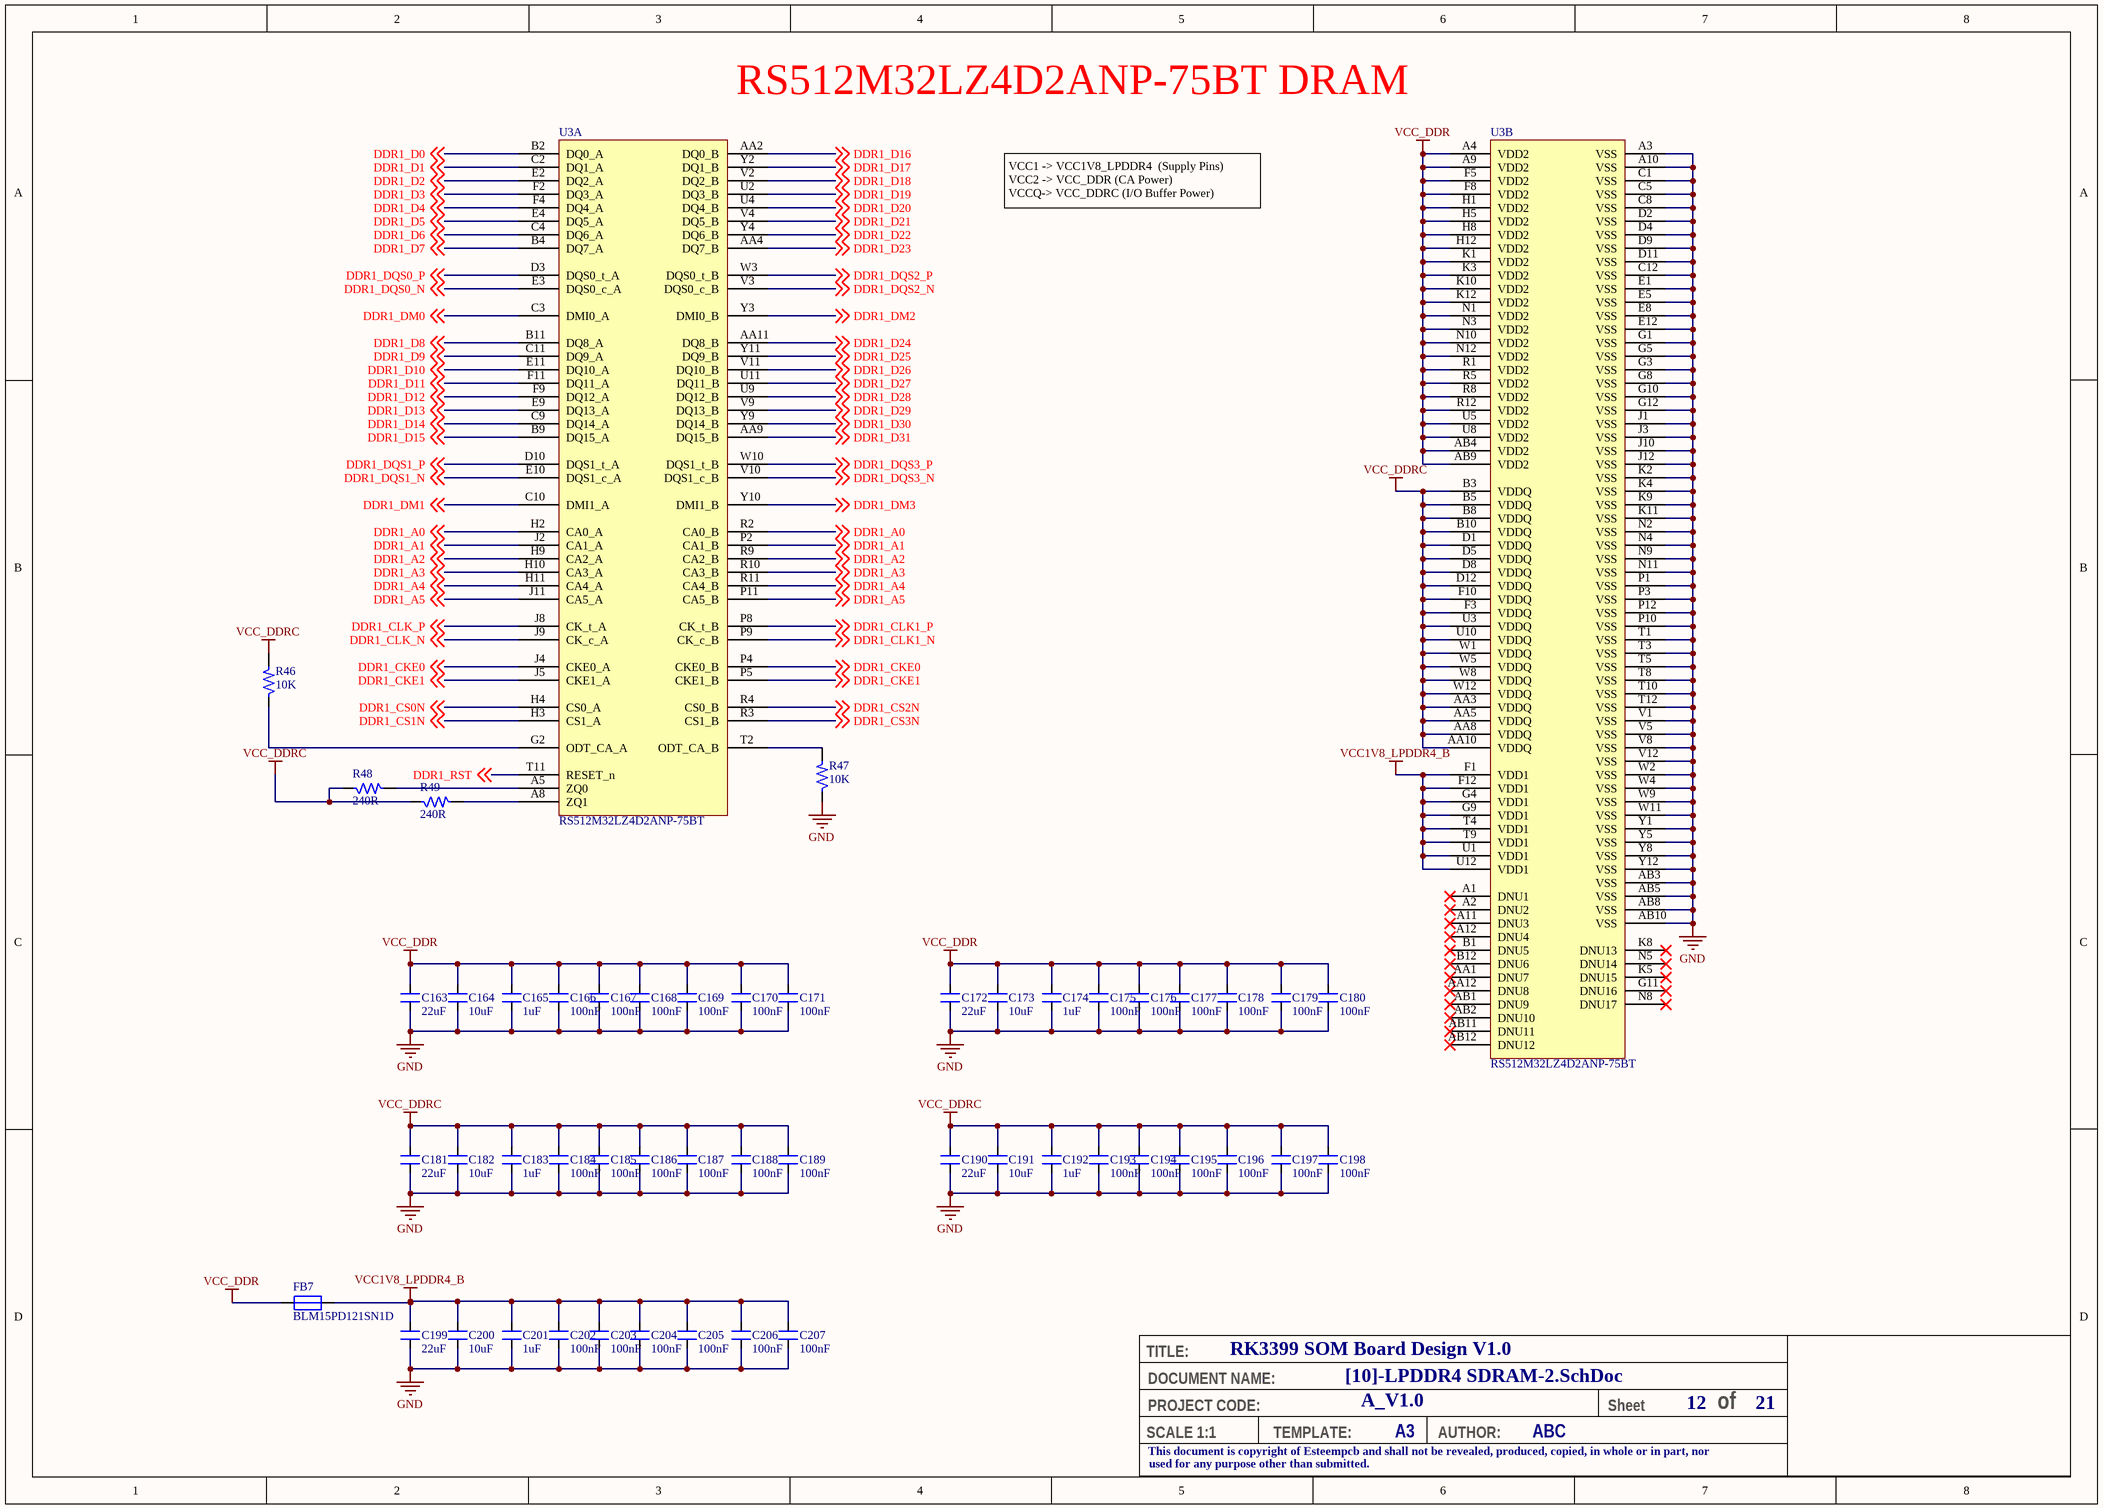
[diagram p11: [10]-LPDDR4 SDRAM-2.SchDoc]

### Parts
C163  22uF  [CAP_0402]
C164  10uF  [CAP_0402]
C165  1uF  [CAP_0201]
C166  100nF  [CAP_0201]
C167  100nF  [CAP_0201]
C168  100nF  [CAP_0201]
C169  100nF  [CAP_0201]
C170  100nF  [CAP_0201]
C171  100nF  [CAP_0201]
C172  22uF  [CAP_0402]
C173  10uF  [CAP_0402]
C174  1uF  [CAP_0201]
C175  100nF  [CAP_0201]
C176  100nF  [CAP_0201]
C177  100nF  [CAP_0201]
C178  100nF  [CAP_0201]
C179  100nF  [CAP_0201]
C180  100nF  [CAP_0201]
C181  22uF  [CAP_0402]
C182  10uF  [CAP_0402]
C183  1uF  [CAP_0201]
C184  100nF  [CAP_0201]
C185  100nF  [CAP_0201]
C186  100nF  [CAP_0201]
C187  100nF  [CAP_0201]
C188  100nF  [CAP_0201]
C189  100nF  [CAP_0201]
C190  22uF  [CAP_0402]
C191  10uF  [CAP_0402]
C192  1uF  [CAP_0201]
C193  100nF  [CAP_0201]
C194  100nF  [CAP_0201]
C195  100nF  [CAP_0201]
C196  100nF  [CAP_0201]
C197  100nF  [CAP_0201]
C198  100nF  [CAP_0201]
C199  22uF  [CAP_0402]
C200  10uF  [CAP_0402]
C201  1uF  [CAP_0201]
C202  100nF  [CAP_0201]
C203  100nF  [CAP_0201]
C204  100nF  [CAP_0201]
C205  100nF  [CAP_0201]
C206  100nF  [CAP_0201]
C207  100nF  [CAP_0201]
FB7  BLM15PD121SN1D  [RES_0402]
R46  10K  [RES_0201]
R47  10K  [RES_0201]
R48  240R  [RES_0201]
R49  240R  [RES_0201]
U3  RS512M32LZ4D2ANP-75BT  [FBGA200_SMD]  (parts A,B of 2)

### Nets
GND: C163.1 C164.1 C165.1 C166.1 C167.1 C168.1 C169.1 C170.1 C171.1 C172.1 C173.1 C174.1 C175.1 C176.1 C177.1 C178.1 C179.1 C180.1 C181.1 C182.1 C183.1 C184.1 C185.1 C186.1 C187.1 C188.1 C189.1 C190.1 C191.1 C192.1 C193.1 C194.1 C195.1 C196.1 C197.1 C198.1 C199.1 C200.1 C201.1 C202.1 C203.1 C204.1 C205.1 C206.1 C207.1 R47.1 U3.A3(VSS) U3.A10(VSS) U3.AB3(VSS) U3.AB5(VSS) U3.AB8(VSS) U3.AB10(VSS) U3.C1(VSS) U3.C5(VSS) U3.C8(VSS) U3.C12(VSS) U3.D2(VSS) U3.D4(VSS) U3.D9(VSS) U3.D11(VSS) U3.E1(VSS) U3.E5(VSS) U3.E8(VSS) U3.E12(VSS) U3.G1(VSS) U3.G3(VSS) U3.G5(VSS) U3.G8(VSS) U3.G10(VSS) U3.G12(VSS) U3.J1(VSS) U3.J3(VSS) U3.J10(VSS) U3.J12(VSS) U3.K2(VSS) U3.K4(VSS) U3.K9(VSS) U3.K11(VSS) U3.N2(VSS) U3.N4(VSS) U3.N9(VSS) U3.N11(VSS) U3.P1(VSS) U3.P3(VSS) U3.P10(VSS) U3.P12(VSS) U3.T1(VSS) U3.T3(VSS) U3.T5(VSS) U3.T8(VSS) U3.T10(VSS) U3.T12(VSS) U3.V1(VSS) U3.V5(VSS) U3.V8(VSS) U3.V12(VSS) U3.W2(VSS) U3.W4(VSS) U3.W9(VSS) U3.W11(VSS) U3.Y1(VSS) U3.Y5(VSS) U3.Y8(VSS) U3.Y12(VSS)
VCC1V8_LPDDR4_B: C199.2 C200.2 C201.2 C202.2 C203.2 C204.2 C205.2 C206.2 C207.2 FB7.2 U3.F1(VDD1) U3.F12(VDD1) U3.G4(VDD1) U3.G9(VDD1) U3.T4(VDD1) U3.T9(VDD1) U3.U1(VDD1) U3.U12(VDD1)
VCC_DDR: C163.2 C164.2 C165.2 C166.2 C167.2 C168.2 C169.2 C170.2 C171.2 C172.2 C173.2 C174.2 C175.2 C176.2 C177.2 C178.2 C179.2 C180.2 FB7.1 U3.A4(VDD2) U3.A9(VDD2) U3.AB4(VDD2) U3.AB9(VDD2) U3.F5(VDD2) U3.F8(VDD2) U3.H1(VDD2) U3.H5(VDD2) U3.H8(VDD2) U3.H12(VDD2) U3.K1(VDD2) U3.K3(VDD2) U3.K10(VDD2) U3.K12(VDD2) U3.N1(VDD2) U3.N3(VDD2) U3.N10(VDD2) U3.N12(VDD2) U3.R1(VDD2) U3.R5(VDD2) U3.R8(VDD2) U3.R12(VDD2) U3.U5(VDD2) U3.U8(VDD2)
VCC_DDRC: C181.2 C182.2 C183.2 C184.2 C185.2 C186.2 C187.2 C188.2 C189.2 C190.2 C191.2 C192.2 C193.2 C194.2 C195.2 C196.2 C197.2 C198.2 R46.2 R48.1 R49.1 U3.AA3(VDDQ) U3.AA5(VDDQ) U3.AA8(VDDQ) U3.AA10(VDDQ) U3.B3(VDDQ) U3.B5(VDDQ) U3.B8(VDDQ) U3.B10(VDDQ) U3.D1(VDDQ) U3.D5(VDDQ) U3.D8(VDDQ) U3.D12(VDDQ) U3.F3(VDDQ) U3.F10(VDDQ) U3.U3(VDDQ) U3.U10(VDDQ) U3.W1(VDDQ) U3.W5(VDDQ) U3.W8(VDDQ) U3.W12(VDDQ)
DDR1_A0: U3.H2(CA0_A) U3.R2(CA0_B) ; off-sheet DDR1_A0
DDR1_A1: U3.J2(CA1_A) U3.P2(CA1_B) ; off-sheet DDR1_A1
DDR1_A2: U3.H9(CA2_A) U3.R9(CA2_B) ; off-sheet DDR1_A2
DDR1_A3: U3.H10(CA3_A) U3.R10(CA3_B) ; off-sheet DDR1_A3
DDR1_A4: U3.H11(CA4_A) U3.R11(CA4_B) ; off-sheet DDR1_A4
DDR1_A5: U3.J11(CA5_A) U3.P11(CA5_B) ; off-sheet DDR1_A5
DDR1_CKE0: U3.J4(CKE0_A) U3.P4(CKE0_B) ; off-sheet DDR1_CKE0
DDR1_CKE1: U3.J5(CKE1_A) U3.P5(CKE1_B) ; off-sheet DDR1_CKE1
DDR1_CLK1_N: U3.P9(CK_c_B) ; off-sheet DDR1_CLK1_N
DDR1_CLK1_P: U3.P8(CK_t_B) ; off-sheet DDR1_CLK1_P
DDR1_CLK_N: U3.J9(CK_c_A) ; off-sheet DDR1_CLK_N
DDR1_CLK_P: U3.J8(CK_t_A) ; off-sheet DDR1_CLK_P
DDR1_CS0N: U3.H4(CS0_A) ; off-sheet DDR1_CS0N
DDR1_CS1N: U3.H3(CS1_A) ; off-sheet DDR1_CS1N
DDR1_CS2N: U3.R4(CS0_B) ; off-sheet DDR1_CS2N
DDR1_CS3N: U3.R3(CS1_B) ; off-sheet DDR1_CS3N
DDR1_D0: U3.B2(DQ0_A) ; off-sheet DDR1_D0
DDR1_D1: U3.C2(DQ1_A) ; off-sheet DDR1_D1
DDR1_D2: U3.E2(DQ2_A) ; off-sheet DDR1_D2
DDR1_D3: U3.F2(DQ3_A) ; off-sheet DDR1_D3
DDR1_D4: U3.F4(DQ4_A) ; off-sheet DDR1_D4
DDR1_D5: U3.E4(DQ5_A) ; off-sheet DDR1_D5
DDR1_D6: U3.C4(DQ6_A) ; off-sheet DDR1_D6
DDR1_D7: U3.B4(DQ7_A) ; off-sheet DDR1_D7
DDR1_D8: U3.B11(DQ8_A) ; off-sheet DDR1_D8
DDR1_D9: U3.C11(DQ9_A) ; off-sheet DDR1_D9
DDR1_D10: U3.E11(DQ10_A) ; off-sheet DDR1_D10
DDR1_D11: U3.F11(DQ11_A) ; off-sheet DDR1_D11
DDR1_D12: U3.F9(DQ12_A) ; off-sheet DDR1_D12
DDR1_D13: U3.E9(DQ13_A) ; off-sheet DDR1_D13
DDR1_D14: U3.C9(DQ14_A) ; off-sheet DDR1_D14
DDR1_D15: U3.B9(DQ15_A) ; off-sheet DDR1_D15
DDR1_D16: U3.AA2(DQ0_B) ; off-sheet DDR1_D16
DDR1_D17: U3.Y2(DQ1_B) ; off-sheet DDR1_D17
DDR1_D18: U3.V2(DQ2_B) ; off-sheet DDR1_D18
DDR1_D19: U3.U2(DQ3_B) ; off-sheet DDR1_D19
DDR1_D20: U3.U4(DQ4_B) ; off-sheet DDR1_D20
DDR1_D21: U3.V4(DQ5_B) ; off-sheet DDR1_D21
DDR1_D22: U3.Y4(DQ6_B) ; off-sheet DDR1_D22
DDR1_D23: U3.AA4(DQ7_B) ; off-sheet DDR1_D23
DDR1_D24: U3.AA11(DQ8_B) ; off-sheet DDR1_D24
DDR1_D25: U3.Y11(DQ9_B) ; off-sheet DDR1_D25
DDR1_D26: U3.V11(DQ10_B) ; off-sheet DDR1_D26
DDR1_D27: U3.U11(DQ11_B) ; off-sheet DDR1_D27
DDR1_D28: U3.U9(DQ12_B) ; off-sheet DDR1_D28
DDR1_D29: U3.V9(DQ13_B) ; off-sheet DDR1_D29
DDR1_D30: U3.Y9(DQ14_B) ; off-sheet DDR1_D30
DDR1_D31: U3.AA9(DQ15_B) ; off-sheet DDR1_D31
DDR1_DM0: U3.C3(DMI0_A) ; off-sheet DDR1_DM0
DDR1_DM1: U3.C10(DMI1_A) ; off-sheet DDR1_DM1
DDR1_DM2: U3.Y3(DMI0_B) ; off-sheet DDR1_DM2
DDR1_DM3: U3.Y10(DMI1_B) ; off-sheet DDR1_DM3
DDR1_DQS0_N: U3.E3(DQS0_c_A) ; off-sheet DDR1_DQS0_N
DDR1_DQS0_P: U3.D3(DQS0_t_A) ; off-sheet DDR1_DQS0_P
DDR1_DQS1_N: U3.E10(DQS1_c_A) ; off-sheet DDR1_DQS1_N
DDR1_DQS1_P: U3.D10(DQS1_t_A) ; off-sheet DDR1_DQS1_P
DDR1_DQS2_N: U3.V3(DQS0_c_B) ; off-sheet DDR1_DQS2_N
DDR1_DQS2_P: U3.W3(DQS0_t_B) ; off-sheet DDR1_DQS2_P
DDR1_DQS3_N: U3.V10(DQS1_c_B) ; off-sheet DDR1_DQS3_N
DDR1_DQS3_P: U3.W10(DQS1_t_B) ; off-sheet DDR1_DQS3_P
DDR1_RST: U3.T11(RESET_n) ; off-sheet DDR1_RST
NetR46_1: R46.1 U3.G2(ODT_CA_A)
NetR47_2: R47.2 U3.T2(ODT_CA_B)
NetR48_2: R48.2 U3.A5(ZQ0)
NetR49_2: R49.2 U3.A8(ZQ1)

Not connected (* = marked no-connect by the designer): U3 A1(DNU1)* A2(DNU2)* A11(DNU3)* A12(DNU4)* AA1(DNU7)* AA12(DNU8)* AB1(DNU9)* AB2(DNU10)* AB11(DNU11)* AB12(DNU12)* B1(DNU5)* B12(DNU6)* G11(DNU16)* K5(DNU15)* K8(DNU13)* N5(DNU14)* N8(DNU17)*

### Notes on the sheet
- (near U3) RS512M32LZ4D2ANP-75BT DRAM
- VCC1 -> VCC1V8_LPDDR4  (Supply Pins)
  VCC2 -> VCC_DDR (CA Power)
  VCCQ-> VCC_DDRC (I/O Buffer Power)
- TITLE:
- DOCUMENT NAME:
- SCALE 1:1
- This document is copyright of Esteempcb and shall not be revealed, produced, copied, in whole or in part, nor
- PROJECT CODE:
- TEMPLATE:
- A3
- AUTHOR:
- Sheet
- of
- used for any purpose other than submitted.

### Library data of the parts
C163 C172 C181 C190 C199 = CAP_22uF-6.3V-20%-0402: as C100 on sheet [8]-RK3399 SDRAM Page; Case/Package: 0402; Supplier-1: Digikey
C164 C173 C182 C191 C200 = CAP_10uF-10V-20%-0402: as C101 on sheet [8]-RK3399 SDRAM Page; Case/Package: 0402; Supplier-1: Digikey
C165 C174 C183 C192 C201 = CAP_1uF-16V-10%-0201: as C102 on sheet [8]-RK3399 SDRAM Page; Case/Package: 0201; Supplier-1: Digikey
C166-C171 C175-C180 C184-C189 C193-C198 C202-C207 = CAP_100nF-25V-10%-0201: as C103-C109 on sheet [8]-RK3399 SDRAM Page; Case/Package: 0201; Supplier-1: Digikey
FB7 = FB_120R-1.3A-100Mhz-0402: as FB2-FB5 on sheet [8]-RK3399 SDRAM Page; Mnaufacturer Part Number: BLM15PD121SN1D; Case/Package: 0402; Supplier-1: Digikey
R46 R47 = RES_10K-0.05W-1%-0201: as R42 on sheet [9]-LPDDR4 SDRAM-1; Case/Package: 0201; Supplier-1: Digikey
R48 R49 = RES_240R-0.05W-1%-0201: as R40 on sheet [8]-RK3399 SDRAM Page; Case/Package: 0201; Supplier-1: Digikey
U3 = IC_RS512M32LZ4D2ANP-75BT: as U2 on sheet [9]-LPDDR4 SDRAM-1; Manufacturer Part Number: RS512M32LZ4D2ANP-75BT; Case/Package: FBGA 200b; Supplier-1: RAYSON

## Sheet [11]-EMMC Chip.SchDoc: RK3399 SOM Board Design V1.0
size A4; Author: AVIRAL MISHRA; DocumentNumber: 13; SheetNumber: 13; SheetTotal: 21; PROJECT CODE: A_V1.0
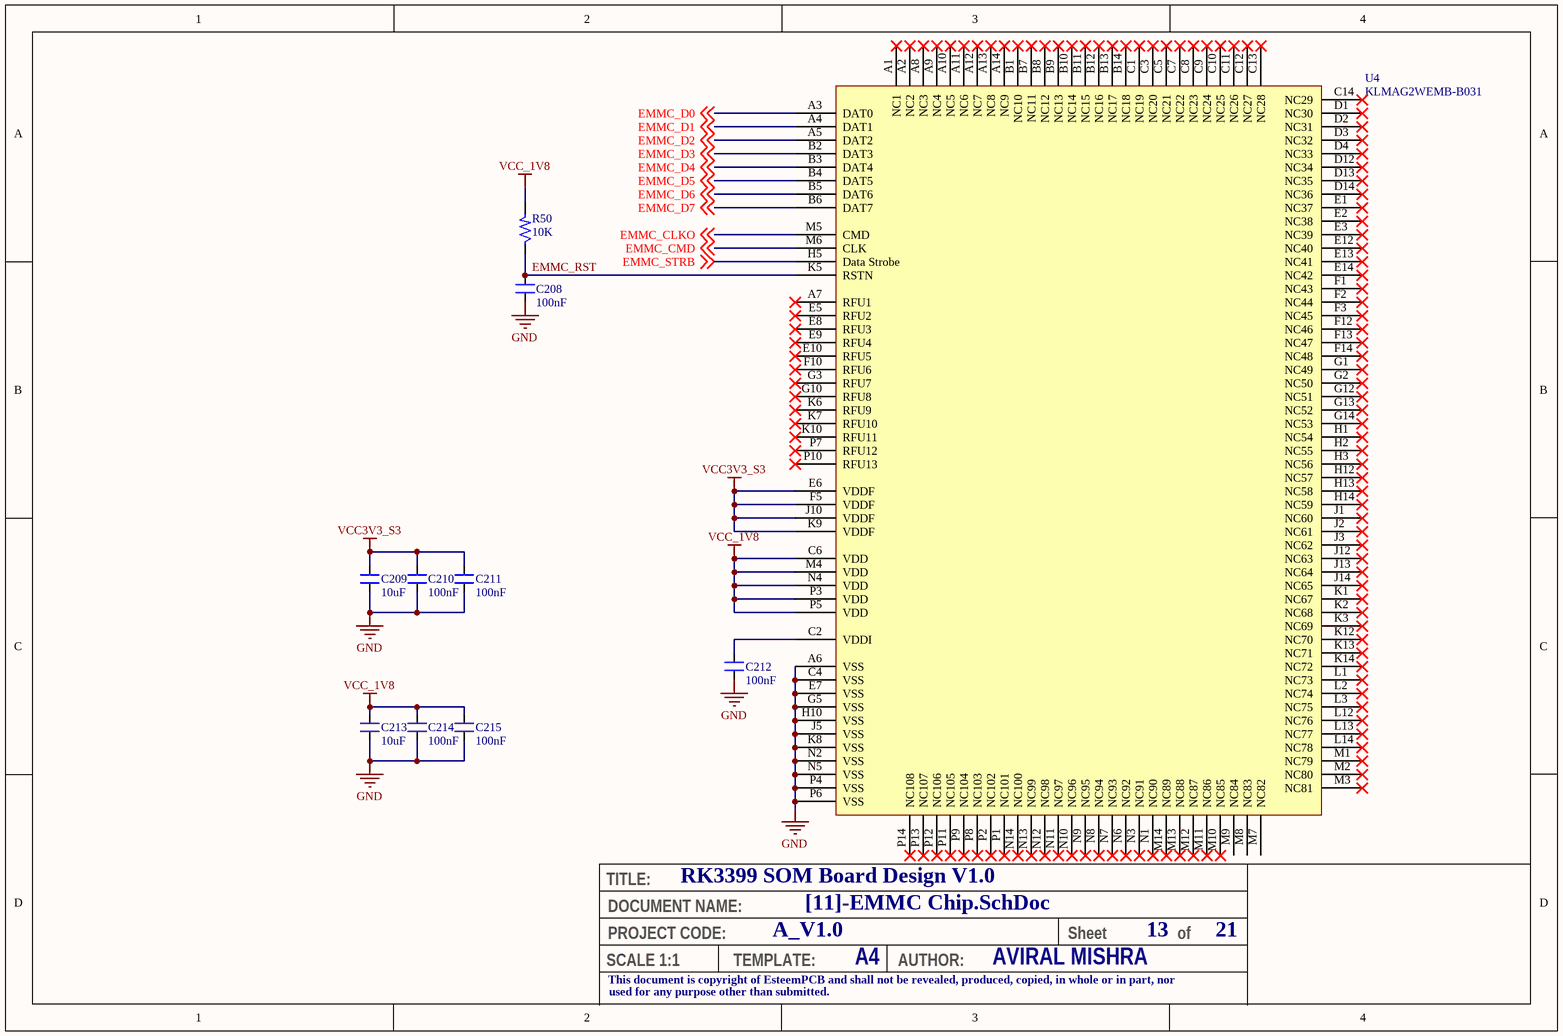
[diagram p12: [11]-EMMC Chip.SchDoc]

### Parts
C208  100nF  [CAP_0201]
C209  10uF  [CAP_0603]
C210  100nF  [CAP_0201]
C211  100nF  [CAP_0201]
C212  100nF  [CAP_0201]
C213  10uF  [CAP_0603]
C214  100nF  [CAP_0201]
C215  100nF  [CAP_0201]
R50  10K  [RES_0201]
U4  KLMAG2WEMB-B031  [BGA153C50P14X14_1150X1300X70]

### Nets
GND: C208.1 C209.1 C210.1 C211.1 C212.1 C213.1 C214.1 C215.1 U4.A6(VSS) U4.C4(VSS) U4.E7(VSS) U4.G5(VSS) U4.H10(VSS) U4.J5(VSS) U4.K8(VSS) U4.N2(VSS) U4.N5(VSS) U4.P4(VSS) U4.P6(VSS)
VCC3V3_S3: C209.2 C210.2 C211.2 U4.E6(VDDF) U4.F5(VDDF) U4.J10(VDDF) U4.K9(VDDF)
VCC_1V8: C213.2 C214.2 C215.2 R50.2 U4.C6(VDD) U4.M4(VDD) U4.N4(VDD) U4.P3(VDD) U4.P5(VDD)
EMMC_CLKO: U4.M5(CMD) ; off-sheet EMMC_CLKO
EMMC_CMD: U4.M6(CLK) ; off-sheet EMMC_CMD
EMMC_D0: U4.A3(DAT0) ; off-sheet EMMC_D0
EMMC_D1: U4.A4(DAT1) ; off-sheet EMMC_D1
EMMC_D2: U4.A5(DAT2) ; off-sheet EMMC_D2
EMMC_D3: U4.B2(DAT3) ; off-sheet EMMC_D3
EMMC_D4: U4.B3(DAT4) ; off-sheet EMMC_D4
EMMC_D5: U4.B4(DAT5) ; off-sheet EMMC_D5
EMMC_D6: U4.B5(DAT6) ; off-sheet EMMC_D6
EMMC_D7: U4.B6(DAT7) ; off-sheet EMMC_D7
EMMC_RST: C208.2 R50.1 U4.K5(RSTN)
EMMC_STRB: U4.H5(Data_Strobe) ; off-sheet EMMC_STRB
NetC212_2: C212.2 U4.C2(VDDI)

Not connected (* = marked no-connect by the designer): U4 A1(NC1)* A2(NC2)* A7(RFU1)* A8(NC3)* A9(NC4)* A10(NC5)* A11(NC6)* A12(NC7)* A13(NC8)* A14(NC9)* B1(NC10)* B7(NC11)* B8(NC12)* B9(NC13)* B10(NC14)* B11(NC15)* B12(NC16)* B13(NC17)* B14(NC18)* C1(NC19)* C3(NC20)* C5(NC21)* C7(NC22)* C8(NC23)* C9(NC24)* C10(NC25)* C11(NC26)* C12(NC27)* C13(NC28)* C14(NC29)* D1(NC30)* D2(NC31)* D3(NC32)* D4(NC33)* D12(NC34)* D13(NC35)* D14(NC36)* E1(NC37)* E2(NC38)* E3(NC39)* E5(RFU2)* E8(RFU3)* E9(RFU4)* E10(RFU5)* E12(NC40)* E13(NC41)* E14(NC42)* F1(NC43)* F2(NC44)* F3(NC45)* F10(RFU6)* F12(NC46)* F13(NC47)* F14(NC48)* G1(NC49)* G2(NC50)* G3(RFU7)* G10(RFU8)* G12(NC51)* G13(NC52)* G14(NC53)* H1(NC54)* H2(NC55)* H3(NC56)* H12(NC57)* H13(NC58)* H14(NC59)* J1(NC60)* J2(NC61)* J3(NC62)* J12(NC63)* J13(NC64)* J14(NC65)* K1(NC67)* K2(NC68)* K3(NC69)* K6(RFU9)* K7(RFU10)* K10(RFU11)* K12(NC70)* K13(NC71)* K14(NC72)* L1(NC73)* L2(NC74)* L3(NC75)* L12(NC76)* L13(NC77)* L14(NC78)* M1(NC79)* M2(NC80)* M3(NC81)* M7(NC82) M8(NC83) M9(NC84) M10(NC85)* M11(NC86)* M12(NC87)* M13(NC88)* M14(NC89)* N1(NC90)* N3(NC91)* N6(NC92)* N7(NC93)* N8(NC94)* N9(NC95)* N10(NC96)* N11(NC97)* N12(NC98)* N13(NC99)* N14(NC100)* P1(NC101)* P2(NC102)* P7(RFU12)* P8(NC103)* P9(NC104)* P10(RFU13)* P11(NC105)* P12(NC106)* P13(NC107)* P14(NC108)*

### Notes on the sheet
- TITLE:
- DOCUMENT NAME:
- SCALE 1:1
- This document is copyright of EsteemPCB and shall not be revealed, produced, copied, in whole or in part, nor
- PROJECT CODE:
- TEMPLATE:
- A4
- AUTHOR:
- Sheet
- of
- used for any purpose other than submitted.

### Library data of the parts
C208 C210-C212 C214 C215 = CAP_100nF-25V-10%-0201: as C103-C109 on sheet [8]-RK3399 SDRAM Page; Case/Package: 0201; Supplier-1: Digikey
C209 C213 = CAP_10uF-10V-10%-0603: 10µF ±10% 10V Ceramic Capacitor X5R 0603 (1608 Metric) /; Manufacturer Part Number: GRM188R61A106KE69J; Manufacturer: Murata Electronics; Case/Package: 0603; Supplier-1: Digikey
R50 = RES_10K-0.05W-1%-0201: as R42 on sheet [9]-LPDDR4 SDRAM-1; Case/Package: 0201; Supplier-1: Digikey
U4 = IC_KLMAG2WEMB-B031: 16GB NAND Flash Memory; Manufacturer: Samsung Electronics; Manufacturer Part Number: KLMAG2WEMB-B031; Case/Package: 153-FBGA; Supplier-1: NA

## Sheet [12]-WIFI Module WF60.SchDoc: RK3399 SOM Board Design V1.0
size A4; Author: AVIRAL MISHRA; DocumentNumber: 14; SheetNumber: 14; SheetTotal: 21; PROJECT CODE: A_V1.0
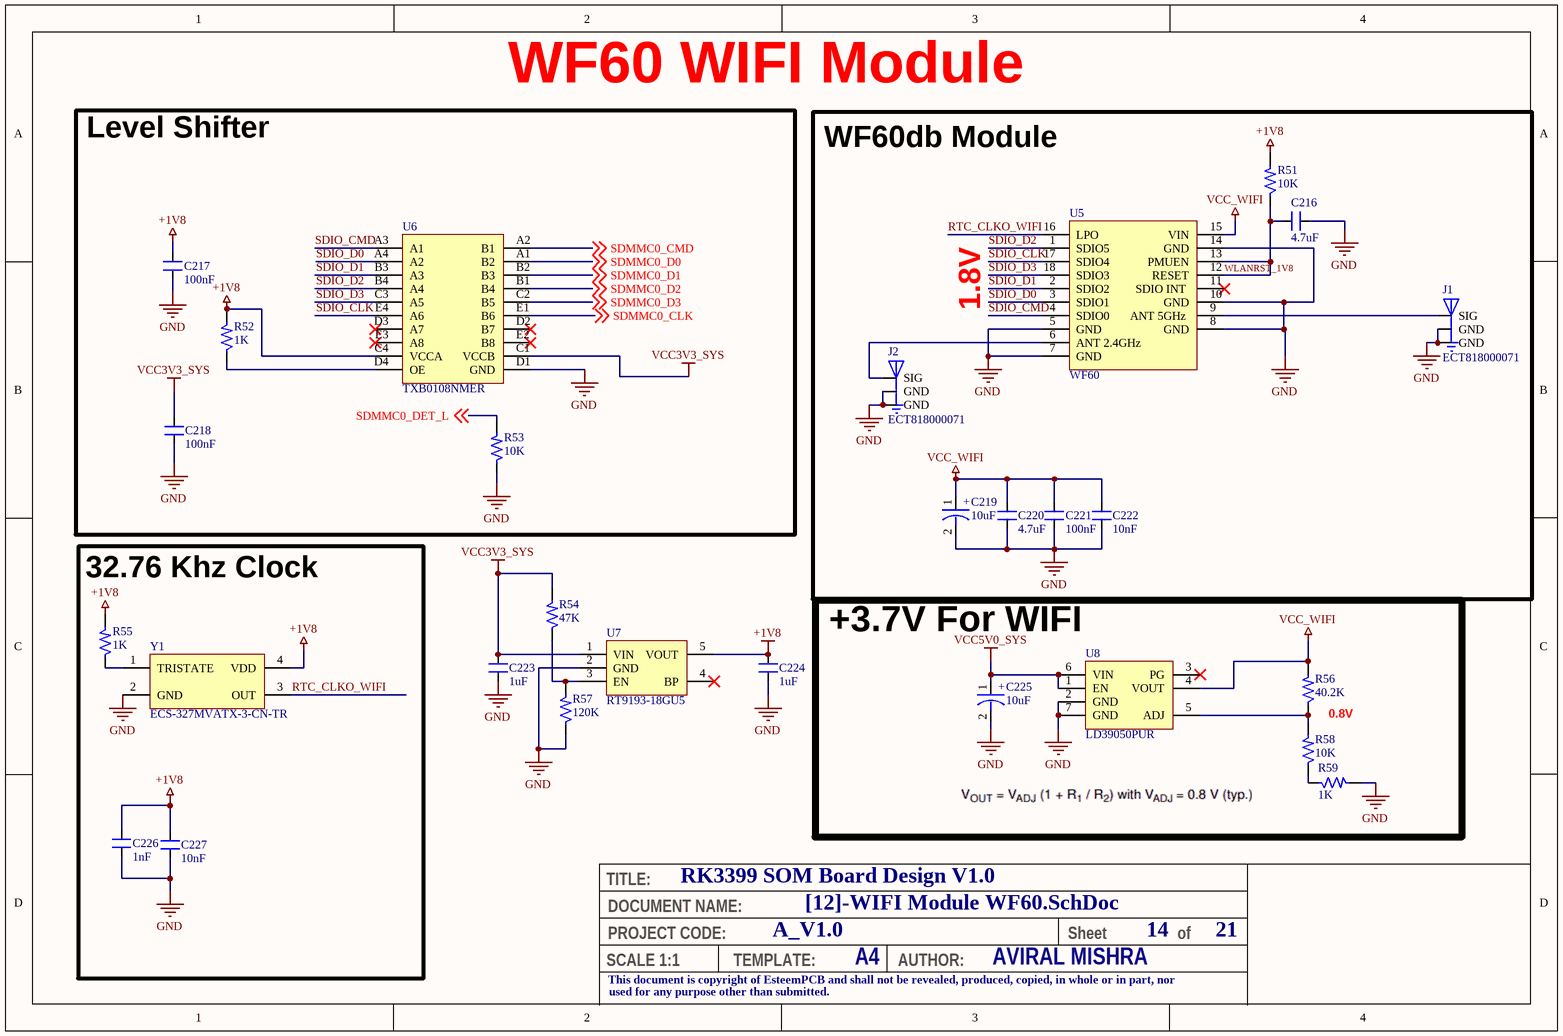
[diagram p13: [12]-WIFI Module WF60.SchDoc]

### Parts
C216  4.7uF  [CAP_0402]
C217  100nF  [CAP_0402]
C218  100nF  [CAP_0402]
C219  10uF  [CAP-T_1206]
C220  4.7uF  [CAP_0402]
C221  100nF  [CAP_0402]
C222  10nF  [CAP_0402]
C223  1uF  [CAP_0402]
C224  1uF  [CAP_0402]
C225  10uF  [CAP-T_1206]
C226  1nF  [CAP_0402]
C227  10nF  [CAP_0402]
J1  ECT818000071  [CON3_UFL_116_SMD_ST]
J2  ECT818000071  [CON3_UFL_116_SMD_ST]
R51  10K  [RES_0402]
R52  1K  [RES_0402]
R53  10K  [RES_0402]
R54  47K  [RES_0402]
R55  1K  [RES_0402]
R56  40.2K  [RES_0805]
R57  120K  [RES_0402]
R58  10K  [RES_0402]
R59  1K  [RES_0402]
U5  WF60  [MOD_WF60]
U6  TXB0108NMER  [NFBGA_31.4_125.9X102.36]
U7  RT9193-18GU5  [SC70-5]
U8  LD39050PUR  [DFN-6_37.4_165_33X15_SMD]
Y1  ECS-327MVATX-3-CN-TR  [XTAL_57_35X31_SMD]

### Blocks framed on the sheet
WF60 WIFI Module: C217 C218 R52 R53 U6
32.76 Khz Clock: C226 C227 R55 Y1
+3.7V For WIFI: C225 R56 R58 R59 U8

### Nets
+1V8: C217.2 C224.2 C226.2 C227.2 R51.2 R52.2 R55.2 U6.C4(VCCA) U7.5(VOUT) Y1.4(VDD)
GND: C216.1 C217.1 C218.1 C219.2 C220.1 C221.1 C222.1 C223.1 C224.1 C225.2 C226.1 C227.1 J1.1(GND) J1.3(GND) J2.1(GND) J2.3(GND) R53.1 R57.1 R59.2 U5.5(GND) U5.7(GND) U5.8(GND) U5.10(GND) U5.14(GND) U6.D1(GND) U7.2(GND) U8.2(GND) U8.7(GND) Y1.2(GND)
VCC3V3_SYS: C218.2 C223.2 R54.2 U6.C1(VCCB) U7.1(VIN)
VCC5V0_SYS: C225.1 U8.1(EN) U8.6(VIN)
VCC_WIFI: C219.1 C220.2 C221.2 C222.2 R56.2 U5.15(VIN) U8.4(VOUT)
RTC_CLKO_WIFI: U5.16(LPO) Y1.3(OUT)
SDIO_CLK: U5.17(SDIO4) U6.E4(A6)
SDIO_CMD: U5.4(SDIO0) U6.A3(A1)
SDIO_D0: U5.3(SDIO1) U6.A4(A2)
SDIO_D1: U5.2(SDIO2) U6.B3(A3)
SDIO_D2: U5.1(SDIO5) U6.B4(A4)
SDIO_D3: U5.18(SDIO3) U6.C3(A5)
SDMMC0_CLK: U6.E1(B6) ; off-sheet SDMMC0_CLK
SDMMC0_CMD: U6.A2(B1) ; off-sheet SDMMC0_CMD
SDMMC0_D0: U6.A1(B2) ; off-sheet SDMMC0_D0
SDMMC0_D1: U6.B2(B3) ; off-sheet SDMMC0_D1
SDMMC0_D2: U6.B1(B4) ; off-sheet SDMMC0_D2
SDMMC0_D3: U6.C2(B5) ; off-sheet SDMMC0_D3
SDMMC0_DET_L: R53.2 ; off-sheet SDMMC0_DET_L
WLANRST_1V8: C216.2 R51.1 U5.12(RESET) U5.13(PMUEN)
NetJ1_2: J1.2(SIG) U5.9(ANT_5GHz)
NetJ2_2: J2.2(SIG) U5.6(ANT_2.4GHz)
NetR52_1: R52.1 U6.D4(OE)
NetR54_1: R54.1 R57.2 U7.3(EN)
NetR55_1: R55.1 Y1.1(TRISTATE)
NetR56_1: R56.1 R58.2 U8.5(ADJ)
NetR58_1: R58.1 R59.1

Not connected (* = marked no-connect by the designer): U5 11(SDIO_INT_)*; U6 D2(B7)* D3(A7)* E2(B8)* E3(A8)*; U7 4(BP)*; U8 3(PG)*

### Notes on the sheet
- Level Shifter
- WF60db Module
- 1.8V
- 0.8V
- TITLE:
- DOCUMENT NAME:
- SCALE 1:1
- This document is copyright of EsteemPCB and shall not be revealed, produced, copied, in whole or in part, nor
- PROJECT CODE:
- TEMPLATE:
- A4
- AUTHOR:
- Sheet
- of
- used for any purpose other than submitted.
- (in symbol CAP-P_10uF-16V-10%-1206) +

### Library data of the parts
C216 C220 = CAP_4.7uF-10V-10%-0402: 4.7µF ±10% 10V Ceramic Capacitor X5R 0402 (1005 Metric) /; Manufacturer: Samsung Electro-Mechanics; Manufacturer Part Number: CL05A475KP5NRNC; Case/Package: 0402; Supplier-1: Digikey
C217 C218 C221 = CAP_100nF-25V-10%-0402: 0.1µF ±10% 25V Ceramic Capacitor X7R 0402 (1005 Metric) /; Manufacturer: Walsin Technology Corporation; Manufacturer Part Number: 0402B104K250CT; Case/Package: 0402; Supplier-1: Digikey
C219 C225 = CAP-P_10uF-16V-10%-1206: 10µF Molded Tantalum Capacitors 16V 1206 (3216 Metric) 3Ohm /; Manufacturer: AVX Corporation; Manufacturer Part Number: TAJA106K016SNJ; Nymble Part Number: 1EA-AA-0003; Alternate Part Number-1: CA45-A016K106T; Case/Package: 1206; Supplier-1: SIRICOM; Supplier Part Number-1: TAJA106K016SNJ; Category: Capacitor; Number of Pins: 2
C222 C227 = CAP_10nF-10V-10%-0402: 10000pF ±10% 10V Ceramic Capacitor X7R 0402 (1005 Metric) /; Manufacturer: AVX Corporation; Manufacturer Part Number: 0402ZC103KAT2A; Case/Package: 0402; Supplier-1: Digikey
C223 C224 = CAP_1uF-16V-10%-0402: 1µF ±10% 16V Ceramic Capacitor X5R 0402 (1005 Metric) /; Manufacturer: Knowles Novacap; Manufacturer Part Number: 0402BW105K160YT; Case/Package: 0402; Supplier-1: Digikey
C226 = CAP_1nF-16V-10%-0402: 1000pF ±10% 16V Ceramic Capacitor X7R 0402 (1005 Metric) /; Manufacturer: Yageo; Manufacturer Part Number: CC0402KRX7R7BB102; Case/Package: 0402; Supplier-1: Digikey
J1 J2 = CON-PLG_3X1-ECT818000071-ST-SMD: SMD RF Connectors/Coaxial Connectors RoHS; Manufacturer: ECT; Manufacturer Part Number: ECT818000071; Case/Package: SMD; Supplier-1: LCSC
R51 R53 R58 = RES_10K-0.1W-1%-0402: 10 kOhms ±1% 0.1W, 1/10W Chip Resistor 0402 (1005 Metric) Anti-Sulfur Thin Film /; Manufacturer: Vishay Beyschlag/Draloric/BC Components; Manufacturer Part Number: MCS04020C1002FE000; Case/Package: 0402; Supplier-1: Digikey
R52 R55 R59 = RES_1K-0.1W-1%-0402: 1 kOhms ±1% 0.1W, 1/10W Chip Resistor 0402 (1005 Metric) Anti-Sulfur Thin Film /; Manufacturer: Vishay Beyschlag/Draloric/BC Components; Manufacturer Part Number: MCS04020C1001FE000; Case/Package: 0402; Supplier-1: Digikey
R54 = RES_47K-0.1W-1%-0402: 47 kOhms ±1% 0.1W, 1/10W Chip Resistor 0402 (1005 Metric) Automotive AEC-Q200 Thick Film /; Manufacturer: Panasonic Electronic Components; Manufacturer Part Number: ERJ-2RKF4702X; Case/Package: 0402; Supplier-1: Digikey
R56 = RES_40.2K-0.125W-1%-0805: 40.2 kOhms ±1% 0.125W, 1/8W Chip Resistor 0805 (2012 Metric) Automotive AEC-Q200 Thick Film /; Manufacturer: TE Connectivity; Manufacturer Part Number: RMCF0805FT40K2; Nymble Part Number: 1EA-AA-0396; Alternate Part Number-1: NA; Case/Package: 0805; Supplier-1: SIRICOM; Supplier Part Number-1: WR08X4022FTL; Category: Resistor; Number of Pins: 2
R57 = RES_120K-0.1W-1%-0402: 120 kOhms ±1% 0.1W, 1/10W Chip Resistor 0402 (1005 Metric) Anti-Sulfur Thin Film /; Manufacturer: Vishay Beyschlag/Draloric/BC Components; Manufacturer Part Number: MCS04020C1203FE000; Case/Package: 0402; Supplier-1: Digikey
U5 = MOD_WF60-SMD: Amp’ed RF Tech presents the WF60 WiFi dual / band module: 802.11abgn.; Nymble Part Number: 1EA-AA-0568; Alternate Part Number-1: NA; Manufacturer: Amp’ed; Manufacturer Part Number: WF60; Case/Package: SMD; Supplier-1: Arrow; Supplier Part Number-1: WF60; Category: Module; Number of Pins: 16
U6 = IC_TXB0108NMER: Translation - Voltage Levels 8-Bit Bidirectional Voltage-Level Shifter with Auto Direction Sensing and +/-15-kV ESD Protect; Manufacturer: Texas Instruments; Manufacturer Part Number: TXB0108NMER; Case/Package: NFBGA-20; Supplier-1: Mouser
U7 = REG_1.8V-300mA-5.5V-SC70-5: Linear Voltage Regulator IC 1 Output 300mA SC-70-5; Manufacturer: Richtek USA Inc.; Manufacturer Part Number: RT9193-18GU5; Case/Package: SC70-5; Supplier-1: Digikey
U8 = REG_5.5V-0~5.1V-0.5A-2.55W-DFN-6: Adjustable 5.5V 0.8V 500mA DFN-6 Linear Voltage Regulators RoHS; Manufacturer: STMicroelectronics; Nymble Part Number: 1EA-AA-0572; Alternate Part Number-1: NA; Manufacturer Part Number: LD39050PUR; Case/Package: DFN-6; Supplier-1: LCSC; Supplier Part Number-1: C222094; Category: Regulators; Number of Pins: 6
Y1 = XTAL_ECS-327MVATX-2-CN-TR: 32.768kHz XO (Standard) CMOS Oscillator 1.6V ~ 3.6V Enable/Disable 4-SMD, No Lead; Manufacturer: ECS INC; Nymble Part Number: 1EA-AA-0561; Alternate Part Number-1: NA; Manufacturer Part Number: ECS-327MVATX-3-CN-TR; Case/Package: SMD-4; Supplier-1: Digikey; Supplier Part Number-1: ECS-327MVATX-3-CN-TR; Category: Crystal; Number of Pins: 4

## Sheet [13]-TYPEC0_PROG.SchDoc: RK3399 SOM Board Design V1.0
size A3; Author: ABC; Organization: Altium Limited; Address1: L3, 12a Rodborough Rd; Address2: Frenchs Forest; Address3: NSW; Address4: Australia 2086; DocumentNumber: 15; SheetNumber: 15; SheetTotal: 21; PROJECT CODE: A_V1.0
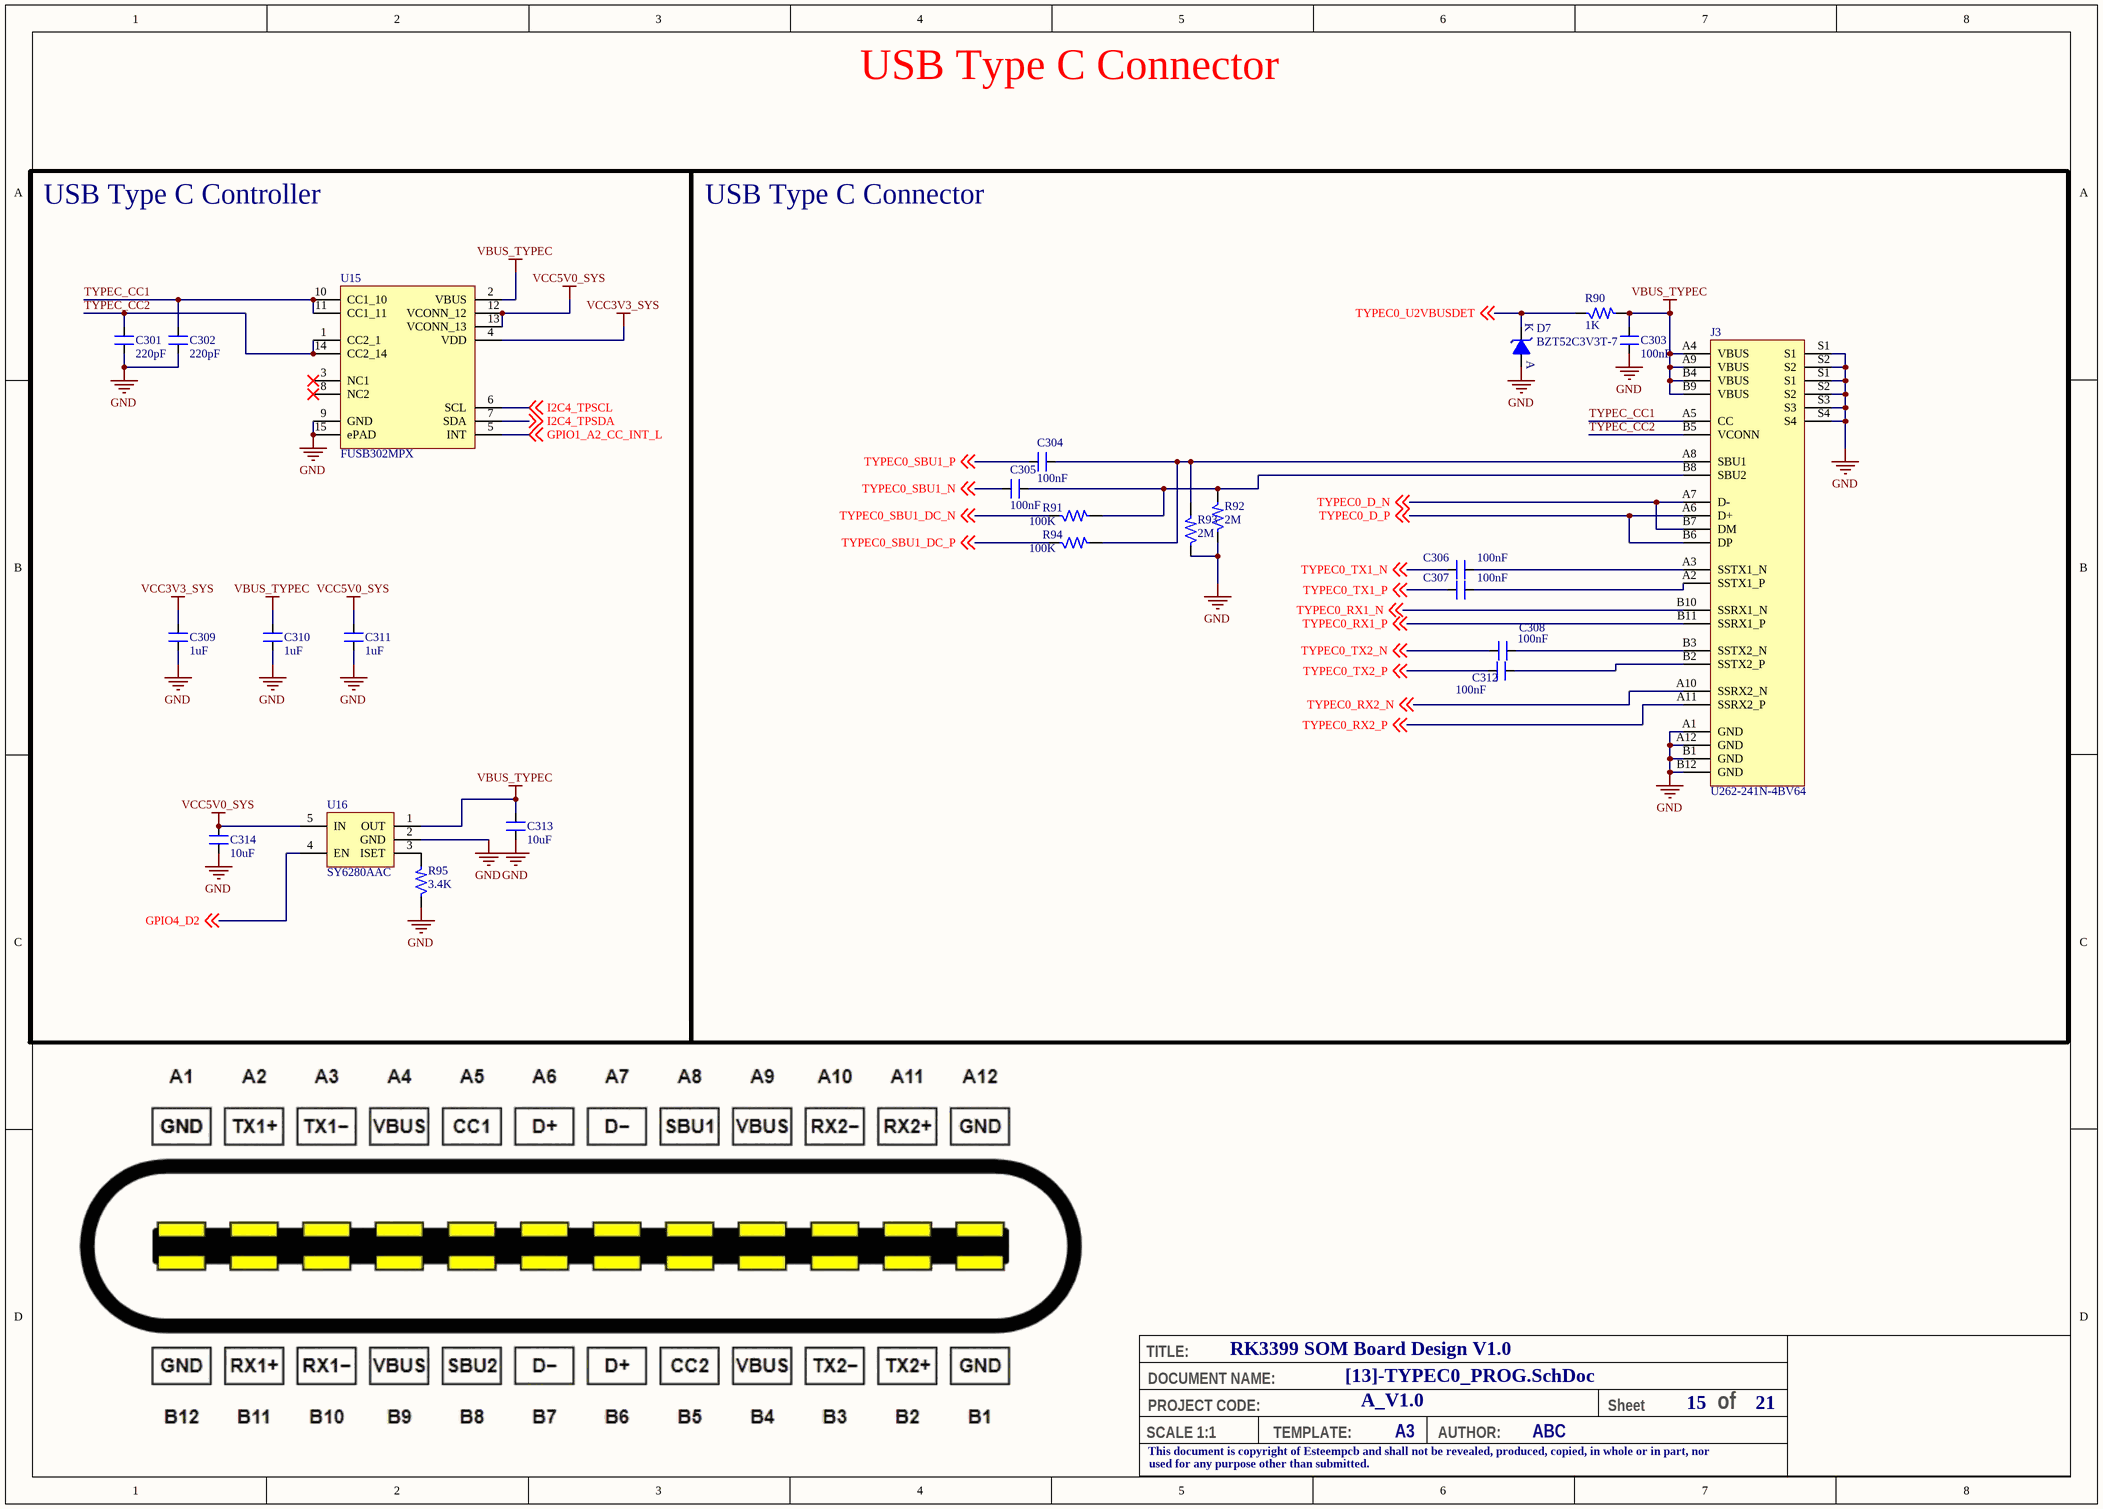
[diagram p14: [13]-TYPEC0_PROG.SchDoc]

### Parts
C301  220pF  [CAP_0402]
C302  220pF  [CAP_0402]
C303  100nF  [CAP_0603]
C304  100nF  [CAP_0402]
C305  100nF  [CAP_0402]
C306  100nF  [CAP_0402]
C307  100nF  [CAP_0402]
C308  100nF  [CAP_0402]
C309  1uF  [CAP_0402]
C310  1uF  [CAP_0402]
C311  1uF  [CAP_0402]
C312  100nF  [CAP_0402]
C313  10uF  [CAP_0402]
C314  10uF  [CAP_0402]
D7  BZT52C3V3T-7  [DIO_SOD523]
J3  U262-241N-4BV64  [CON24_19.64_U262-241N-4BV64_TH_RA]
R90  1K  [RES_0402]
R91  100K  [RES_0402]
R92  2M  [RES_0402]
R93  2M  [RES_0402]
R94  100K  [RES_0402]
R95  3.4K  [RES_0402]
U15  FUSB302MPX  [MLP-14_98.4X98.4_SMD]
U16  SY6280AAC  [SOT23-5]

### Blocks framed on the sheet
USB Type C Controller: C301 C302 C309-C311 C313 C314 R95 U15 U16
USB Type C Connector: C303-C308 C312 D7 J3 R90-R94

### Nets
GND: C301.1 C302.1 C303.1 C309.1 C310.1 C311.1 C313.1 C314.1 D7.A J3.A1(GND) J3.A12(GND) J3.B1(GND) J3.B12(GND) J3.S1 J3.S2 J3.S3 J3.S4 R92.1 R93.1 R95.1 U15.9(GND) U15.15(ePAD) U16.2(GND)
VBUS_TYPEC: C303.2 C310.2 C313.2 J3.A4(VBUS) J3.A9(VBUS) J3.B4(VBUS) J3.B9(VBUS) R90.2 U15.2(VBUS) U16.1(OUT)
VCC3V3_SYS: C309.2 U15.4(VDD)
VCC5V0_SYS: C311.2 C314.2 U15.12(VCONN_12) U15.13(VCONN_13) U16.5(IN)
GPIO1_A2_CC_INT_L: U15.5(INT) ; off-sheet GPIO1_A2_CC_INT_L
GPIO4_D2: U16.4(EN) ; off-sheet GPIO4_D2
I2C4_TPSCL: U15.6(SCL) ; off-sheet I2C4_TPSCL
I2C4_TPSDA: U15.7(SDA) ; off-sheet I2C4_TPSDA
TYPEC0_D_N: J3.A7(D-) J3.B7(DM) ; off-sheet TYPEC0_D_N
TYPEC0_D_P: J3.A6(D+) J3.B6(DP) ; off-sheet TYPEC0_D_P
TYPEC0_RX1_N: J3.B10(SSRX1_N) ; off-sheet TYPEC0_RX1_N
TYPEC0_RX1_P: J3.B11(SSRX1_P) ; off-sheet TYPEC0_RX1_P
TYPEC0_RX2_N: J3.A10(SSRX2_N) ; off-sheet TYPEC0_RX2_N
TYPEC0_RX2_P: J3.A11(SSRX2_P) ; off-sheet TYPEC0_RX2_P
TYPEC0_SBU1_DC_N: R91.1 ; off-sheet TYPEC0_SBU1_DC_N
TYPEC0_SBU1_DC_P: R94.1 ; off-sheet TYPEC0_SBU1_DC_P
TYPEC0_SBU1_N: C305.1 ; off-sheet TYPEC0_SBU1_N
TYPEC0_SBU1_P: C304.1 ; off-sheet TYPEC0_SBU1_P
TYPEC0_TX1_N: C306.1 ; off-sheet TYPEC0_TX1_N
TYPEC0_TX1_P: C307.1 ; off-sheet TYPEC0_TX1_P
TYPEC0_TX2_N: C308.1 ; off-sheet TYPEC0_TX2_N
TYPEC0_TX2_P: C312.1 ; off-sheet TYPEC0_TX2_P
TYPEC0_U2VBUSDET: D7.K R90.1 ; off-sheet TYPEC0_U2VBUSDET
TYPEC_CC1: C302.2 J3.A5(CC) U15.10(CC1_10) U15.11(CC1_11)
TYPEC_CC2: C301.2 J3.B5(VCONN) U15.1(CC2_1) U15.14(CC2_14)
NetC304_2: C304.2 J3.A8(SBU1) R93.2 R94.2
NetC305_2: C305.2 J3.B8(SBU2) R91.2 R92.2
NetC306_2: C306.2 J3.A3(SSTX1_N)
NetC307_2: C307.2 J3.A2(SSTX1_P)
NetC308_2: C308.2 J3.B3(SSTX2_N)
NetC312_2: C312.2 J3.B2(SSTX2_P)
NetR95_2: R95.2 U16.3(ISET)

Not connected (* = marked no-connect by the designer): U15 3(NC1)* 8(NC2)*

### Notes on the sheet
- USB Type C Connector
- TITLE:
- DOCUMENT NAME:
- SCALE 1:1
- This document is copyright of Esteempcb and shall not be revealed, produced, copied, in whole or in part, nor
- PROJECT CODE:
- TEMPLATE:
- A3
- AUTHOR:
- Sheet
- of
- used for any purpose other than submitted.

### Library data of the parts
C301 C302 = CAP_220pF-10V-10%-0402: 220pF ±10% 10V Ceramic Capacitor X7R 0402 (1005 Metric) /; Manufacturer: KEMET; Manufacturer Part Number: C0402C221K8RAC7867; Case/Package: 0402; Supplier-1: Digikey
C303 = CAP_100nF-10V-5%-0603: 0.1µF ±10% 10V Ceramic Capacitor X7R 0603 (1608 Metric) /; Manufacturer: Yageo; Manufacturer Part Number: CC0603KRX7R6BB104; Case/Package: 0603; Supplier-1: Digikey
C304-C308 C312 = CAP_100nF-25V-10%-0402: as C217 on sheet [12]-WIFI Module WF60; Case/Package: 0402; Supplier-1: Digikey
C309-C311 = CAP_1uF-10V-10%-0402: 1µF ±10% 10V Ceramic Capacitor X6S 0402 (1005 Metric) /; Manufacturer: Murata Electronics; Manufacturer Part Number: GRT155C81A105KE01D; Case/Package: 0402; Supplier-1: Digikey
C313 C314 = CAP_10uF-10V-20%-0402: as C101 on sheet [8]-RK3399 SDRAM Page; Case/Package: 0402; Supplier-1: Digikey
D7 = DIO-Z_3.3V-300mW-SOD-523: Zener Diode 3.3V 300mW ±6% Surface Mount SOD-523 /; Manufacturer: Diodes Incorporated; Manufacturer Part Number: BZT52C3V3T-7; Case/Package: SOD523; Supplier-1: Digikey
J3 = CON-TYPEC_U262-241N-4BV64-SMD: USB - Type C Female 24 SMD USB Connectors RoHS; Manufacturer: XKB Connectivity; Manufacturer Part Number: U262-241N-4BV64; Case/Package: SMD; Supplier-1: LCSC
R90 = RES_1K-0.1W-1%-0402: as R52 on sheet [12]-WIFI Module WF60; Case/Package: 0402; Supplier-1: Digikey
R91 R94 = RES_100K-0.1W-1%-0402: 100 kOhms ±1% 0.1W, 1/10W Chip Resistor 0402 (1005 Metric) Anti-Sulfur Thin Film /; Manufacturer: Vishay Beyschlag/Draloric/BC Components; Manufacturer Part Number: MCS04020C1003FE000; Case/Package: 0402; Supplier-1: Digikey
R92 R93 = RES_2M-0.1W-1%-0402: 2 MOhms ±1% 0.1W, 1/10W Chip Resistor 0402 (1005 Metric) Anti-Sulfur Thin Film /; Manufacturer: Vishay Beyschlag/Draloric/BC Components; Manufacturer Part Number: MCS04020C2004FE000; Case/Package: 0402; Supplier-1: Digikey
R95 = RES_3.4K-0.1W-1%-0402: 3.4 kOhms ±1% 0.1W, 1/10W Chip Resistor 0402 (1005 Metric) Automotive AEC-Q200 Thick Film /; Manufacturer: Panasonic Electronic Components; Manufacturer Part Number: ERJ-2RKF3401X; Case/Package: 0402; Supplier-1: Digikey
U15 = IC_FUSB302MPX: USB Controller USB 3.1 USB Interface 14-MLP (2.5x2.5); Manufacturer: ON Semiconductor; Manufacturer Part Number: FUSB302MPX; Case/Package: 14-MLP; Supplier-1: Digikey
U16 = REG-ADJ_5.5V-5.5V-1.25A-SOT-23-5: SOT-23-5 PMIC - Power Distribution Switches RoHS; Manufacturer: Silergy Corp; Manufacturer Part Number: SY6280AAC; Case/Package: SOT-23-5; Supplier-1: LCSC